# EAGLE design Single_CH_CTRL (EAGLE 9.6.2)

## Sheet 1 of 3
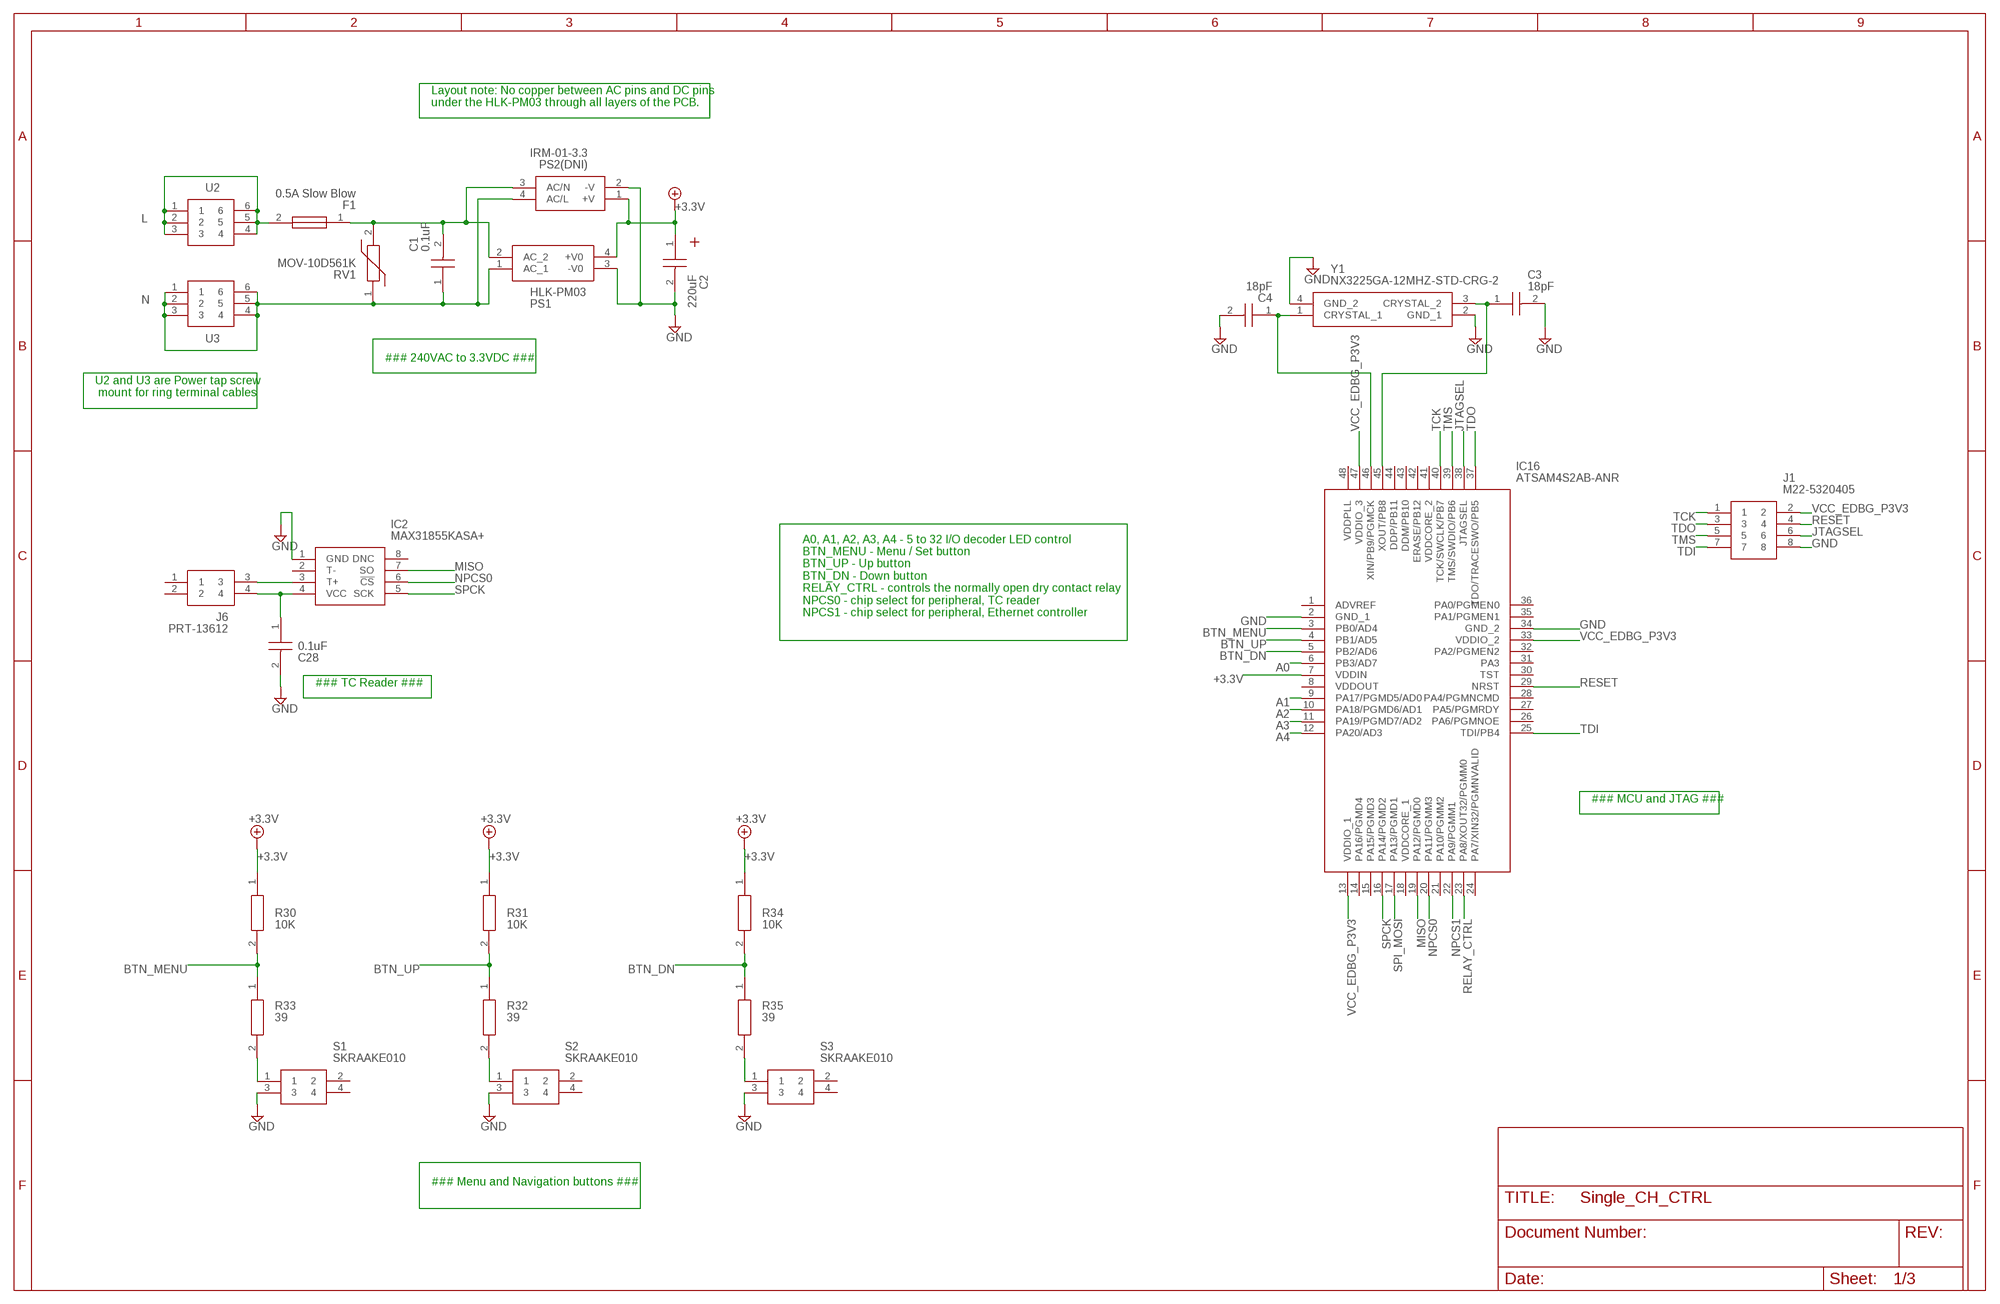
[diagram p0: schematic, sheet 1]

### Parts
C1  0.1uF  B32922X2104K000  [B32922X_(18_X_5)]
C2  220uF  860010473011  [CAPPRD250W52D630H1250]
C3  18pF  04025U180FAT2A  [CAPC1005X56N]
C4  18pF  04025U180FAT2A  [CAPC1005X56N]
C28  0.1uF  C0805C104K5RAC7411  [CAPC2012X88N]
F1  0.5A Slow Blow  RST_500_AMMO  [RST500AMMO]
IC2  MAX31855KASA+  [SOIC127P600X175-8N]
IC16  ATSAM4S2AB-ANR  [QFP50P900X900X160-48N]
J1  M22-5320405  [HUSSP8W50P200_2X4_800X400X500P]
J6  PRT-13612  [PRT13612]
PS1  HLK-PM03  [HLKPM03]
PS2(DNI)  IRM-01-3.3  [IRM015]
R30  10K  CRCW040210K0FKEDC  [RESC1005X35N]
R31  10K  CRCW040210K0FKEDC  [RESC1005X35N]
R32  39  CR0402-FX-39R0GLF  [RESC1005X40N]
R33  39  CR0402-FX-39R0GLF  [RESC1005X40N]
R34  10K  CRCW040210K0FKEDC  [RESC1005X35N]
R35  39  CR0402-FX-39R0GLF  [RESC1005X40N]
RV1  MOV-10D561K  [MOV10D561K]
S1  SKRAAKE010  [SKRAAKE010_1]
S2  SKRAAKE010  [SKRAAKE010_1]
S3  SKRAAKE010  [SKRAAKE010_1]
U2  5055323-9  [50553239]
U3  5055323-9  [50553239]
Y1  NX3225GA-12MHZ-STD-CRG-2  [NX3225GA12MHZSTDCRG2]

### Nets
+3.3V: C2.1(+) IC16.7(VDDIN) PS1.4(+V0) PS2(DNI).1(+V) R30.1 R31.1 R34.1 ; also sheet 2
A0: IC16.6(PB3/AD7)
A1: IC16.9(PA17/PGMD5/AD0)
A2: IC16.10(PA18/PGMD6/AD1)
A3: IC16.11(PA19/PGMD7/AD2)
A4: IC16.12(PA20/AD3)
BTN_DN: IC16.5(PB2/AD6) R34.2 R35.1
BTN_MENU: IC16.3(PB0/AD4) R30.2 R33.1
BTN_UP: IC16.4(PB1/AD5) R31.2 R32.1
GND: C2.2(-) C3.2 C4.2 C28.2 IC2.1(GND) IC16.2(GND_1) IC16.34(GND_2) J1.8 PS1.3(-V0) PS2(DNI).2(-V) S1.3 S2.3 S3.3 Y1.2(GND_1) Y1.4(GND_2) ; also sheet 2,3
JTAGSEL: IC16.38(JTAGSEL) J1.6
L: F1.2 U2.1 U2.2 U2.3 U2.4 U2.5 U2.6
MISO: IC2.7(SO) IC16.19(PA12/PGMD0) ; also sheet 2
N: C1.1 PS1.1(AC_1) PS2(DNI).4(AC/L) RV1.1 U3.1 U3.2 U3.3 U3.4 U3.5 U3.6
N$1: C1.2 F1.1 PS1.2(AC_2) PS2(DNI).3(AC/N) RV1.2
N$2: C3.1 IC16.45(XOUT/PB8) Y1.3(CRYSTAL_2)
N$3: C4.1 IC16.46(XIN/PB9/PGMCK) Y1.1(CRYSTAL_1)
N$80: R33.2 S1.1
N$82: R32.2 S2.1
N$84: R35.2 S3.1
N$221: C28.1 IC2.4(VCC) J6.4
N$225: IC2.3(T+) J6.3
NPCS0: IC2.6(!CS) IC16.20(PA11/PGMM3)
NPCS1: IC16.22(PA9/PGMM1) ; also sheet 2
RELAY_CTRL: IC16.23(PA8/XOUT32/PGMM0) ; also sheet 2
RESET: IC16.29(NRST) J1.4
SPCK: IC2.5(SCK) IC16.16(PA14/PGMD2) ; also sheet 2
SPI_MOSI: IC16.17(PA13/PGMD1) ; also sheet 2
TCK: IC16.40(TCK/SWCLK/PB7) J1.1
TDI: IC16.25(TDI/PB4) J1.7
TDO: IC16.37(TDO/TRACESWO/PB5) J1.3
TMS: IC16.39(TMS/SWDIO/PB6) J1.5
VCC_EDBG_P3V3: IC16.13(VDDIO_1) IC16.33(VDDIO_2) IC16.47(VDDIO_3) J1.2
Unconnected: IC2.2(T-) IC2.8(DNC) IC16.1(ADVREF) IC16.8(VDDOUT) IC16.14(PA16/PGMD4) IC16.15(PA15/PGMD3) IC16.18(VDDCORE_1) IC16.21(PA10/PGMM2) IC16.24(PA7/XIN32/PGMNVALID) IC16.26(PA6/PGMNOE) IC16.27(PA5/PGMRDY) IC16.28(PA4/PGMNCMD) IC16.30(TST) IC16.31(PA3) IC16.32(PA2/PGMEN2) IC16.35(PA1/PGMEN1) IC16.36(PA0/PGMEN0) IC16.41(VDDCORE_2) IC16.42(ERASE/PB12) IC16.43(DDM/PB10) IC16.44(DDP/PB11) IC16.48(VDDPLL) J6.1 J6.2 S1.2 S1.4 S2.2 S2.4 S3.2 S3.4

### Notes on the sheet
- Layout note: No copper between AC pins and DC pins 
  under the HLK-PM03 through all layers of the PCB.
- ### 240VAC to 3.3VDC ###
- U2 and U3 are Power tap screw
   mount for ring terminal cables
- A0, A1, A2, A3, A4 - 5 to 32 I/O decoder LED control
  BTN_MENU - Menu / Set button
  BTN_UP - Up button
  BTN_DN - Down button
  RELAY_CTRL - controls the normally open dry contact relay
  NPCS0 - chip select for peripheral, TC reader
  NPCS1 - chip select for peripheral, Ethernet controller
- ### TC Reader ###
- ### MCU and JTAG ###
- ### Menu and Navigation buttons ###

## Sheet 2 of 3
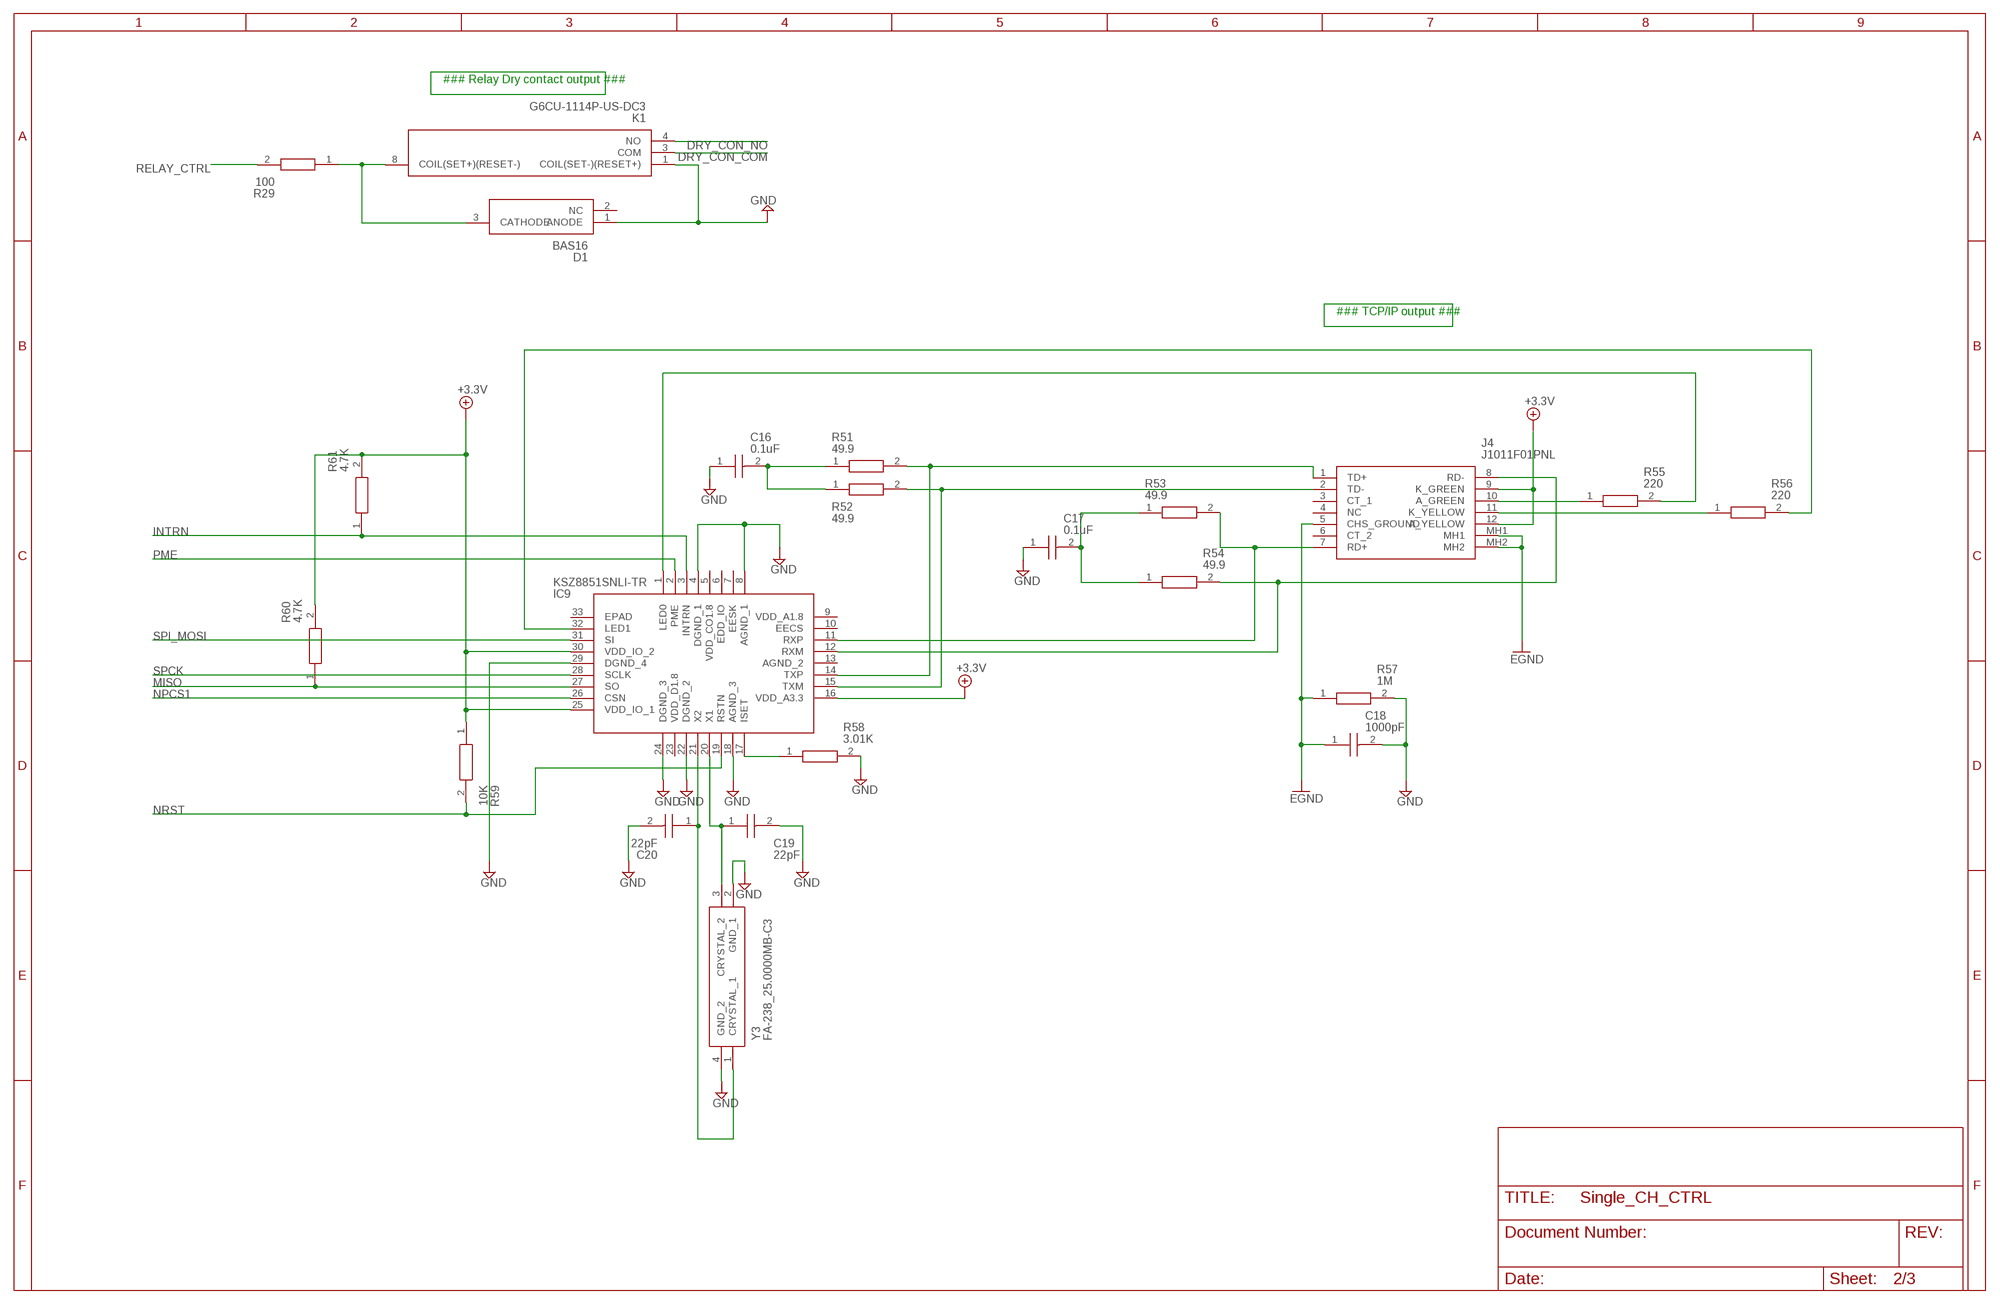
[diagram p1: schematic, sheet 2]

### Parts
C16  0.1uF  C0402C104K4RACTU  [C0402]
C17  0.1uF  C0402C104K4RACTU  [C0402]
C18  1000pF  C4520X7R3D102K130KA  [C4520_COMMERCIAL]
C19  22pF  CBR04C220J5GAC  [CBR04C]
C20  22pF  CBR04C220J5GAC  [CBR04C]
D1  BAS16  [SOT95P240X110-3N]
IC9  KSZ8851SNLI-TR  [QFN50P500X500X100-33N]
J4  J1011F01PNL  [J1011F01PNL]
K1  G6CU-1114P-US-DC3  [G6CU1114PUSDC3]
R29  100  ERJ-PA3F1000V  [ERJP03_PA3_(0603)]
R51  49.9  ERJ-U02F49R9X  [ERJS02_U02_(0402)]
R52  49.9  ERJ-U02F49R9X  [ERJS02_U02_(0402)]
R53  49.9  ERJ-U02F49R9X  [ERJS02_U02_(0402)]
R54  49.9  ERJ-U02F49R9X  [ERJS02_U02_(0402)]
R55  220  CR0402-JW-221GLF  [RESC1005X40N]
R56  220  CR0402-JW-221GLF  [RESC1005X40N]
R57  1M  CHV0805-FX-1004EST  [RESC2012X60N]
R58  3.01K  RC0402FR-073K01L  [RESC1005X40N]
R59  10K  RC0402FR-0710KP  [RESC1005X40N]
R60  4.7K  CR0402-FX-4701GLF  [RESC1005X40N]
R61  4.7K  CR0402-FX-4701GLF  [RESC1005X40N]
Y3  FA-238_25.0000MB-C3  [FA238300000MBC0]

### Nets
+3.3V: IC9.16(VDD_A3.3) IC9.25(VDD_IO_1) IC9.30(VDD_IO_2) J4.9(K_GREEN) J4.12(A_YELLOW) R59.1 R60.2 R61.2 ; also sheet 1
DRY_CON_COM: K1.3(COM)
DRY_CON_NO: K1.4(NO)
GND: C16.1 C17.1 C18.1 C18.2 C19.2 C20.2 D1.1(ANODE) IC9.4(DGND_1) IC9.8(AGND_1) IC9.18(AGND_3) IC9.22(DGND_2) IC9.24(DGND_3) IC9.29(DGND_4) J4.5(CHS_GROUND) J4.MH1 J4.MH2 K1.1(COIL(SET-)(RESET+)) R57.1 R57.2 R58.2 Y3.2(GND_1) Y3.4(GND_2) ; supply symbol labelled EGND ; also sheet 1,3
INTRN: IC9.3(INTRN) R61.1
MISO: IC9.27(SO) R60.1 ; also sheet 1
N$78: D1.3(CATHODE) K1.8(COIL(SET+)(RESET-)) R29.1
N$120: IC9.14(TXP) J4.1(TD+) R51.2
N$121: IC9.15(TXM) J4.2(TD-) R52.2
N$122: IC9.11(RXP) J4.7(RD+) R53.2
N$123: C16.2 R51.1 R52.1
N$124: C17.2 R53.1 R54.1
N$125: IC9.12(RXM) J4.8(RD-) R54.2
N$126: J4.10(A_GREEN) R55.1
N$127: J4.11(K_YELLOW) R56.1
N$128: IC9.1(LED0) R55.2
N$129: IC9.32(LED1) R56.2
N$130: C19.1 IC9.20(X1) Y3.3(CRYSTAL_2)
N$131: C20.1 IC9.21(X2) Y3.1(CRYSTAL_1)
N$132: IC9.17(ISET) R58.1
NPCS1: IC9.26(CSN) ; also sheet 1
NRST: IC9.19(RSTN) R59.2
PME: IC9.2(PME)
RELAY_CTRL: R29.2 ; also sheet 1
SPCK: IC9.28(SCLK) ; also sheet 1
SPI_MOSI: IC9.31(SI) ; also sheet 1
Unconnected: D1.2(NC) IC9.5(VDD_CO1.8) IC9.6(EDD_IO) IC9.7(EESK) IC9.9(VDD_A1.8) IC9.10(EECS) IC9.13(AGND_2) IC9.23(VDD_D1.8) IC9.33(EPAD) J4.3(CT_1) J4.4(NC) J4.6(CT_2)

### Notes on the sheet
- ### Relay Dry contact output ###
- ### TCP/IP output ###

## Sheet 3 of 3
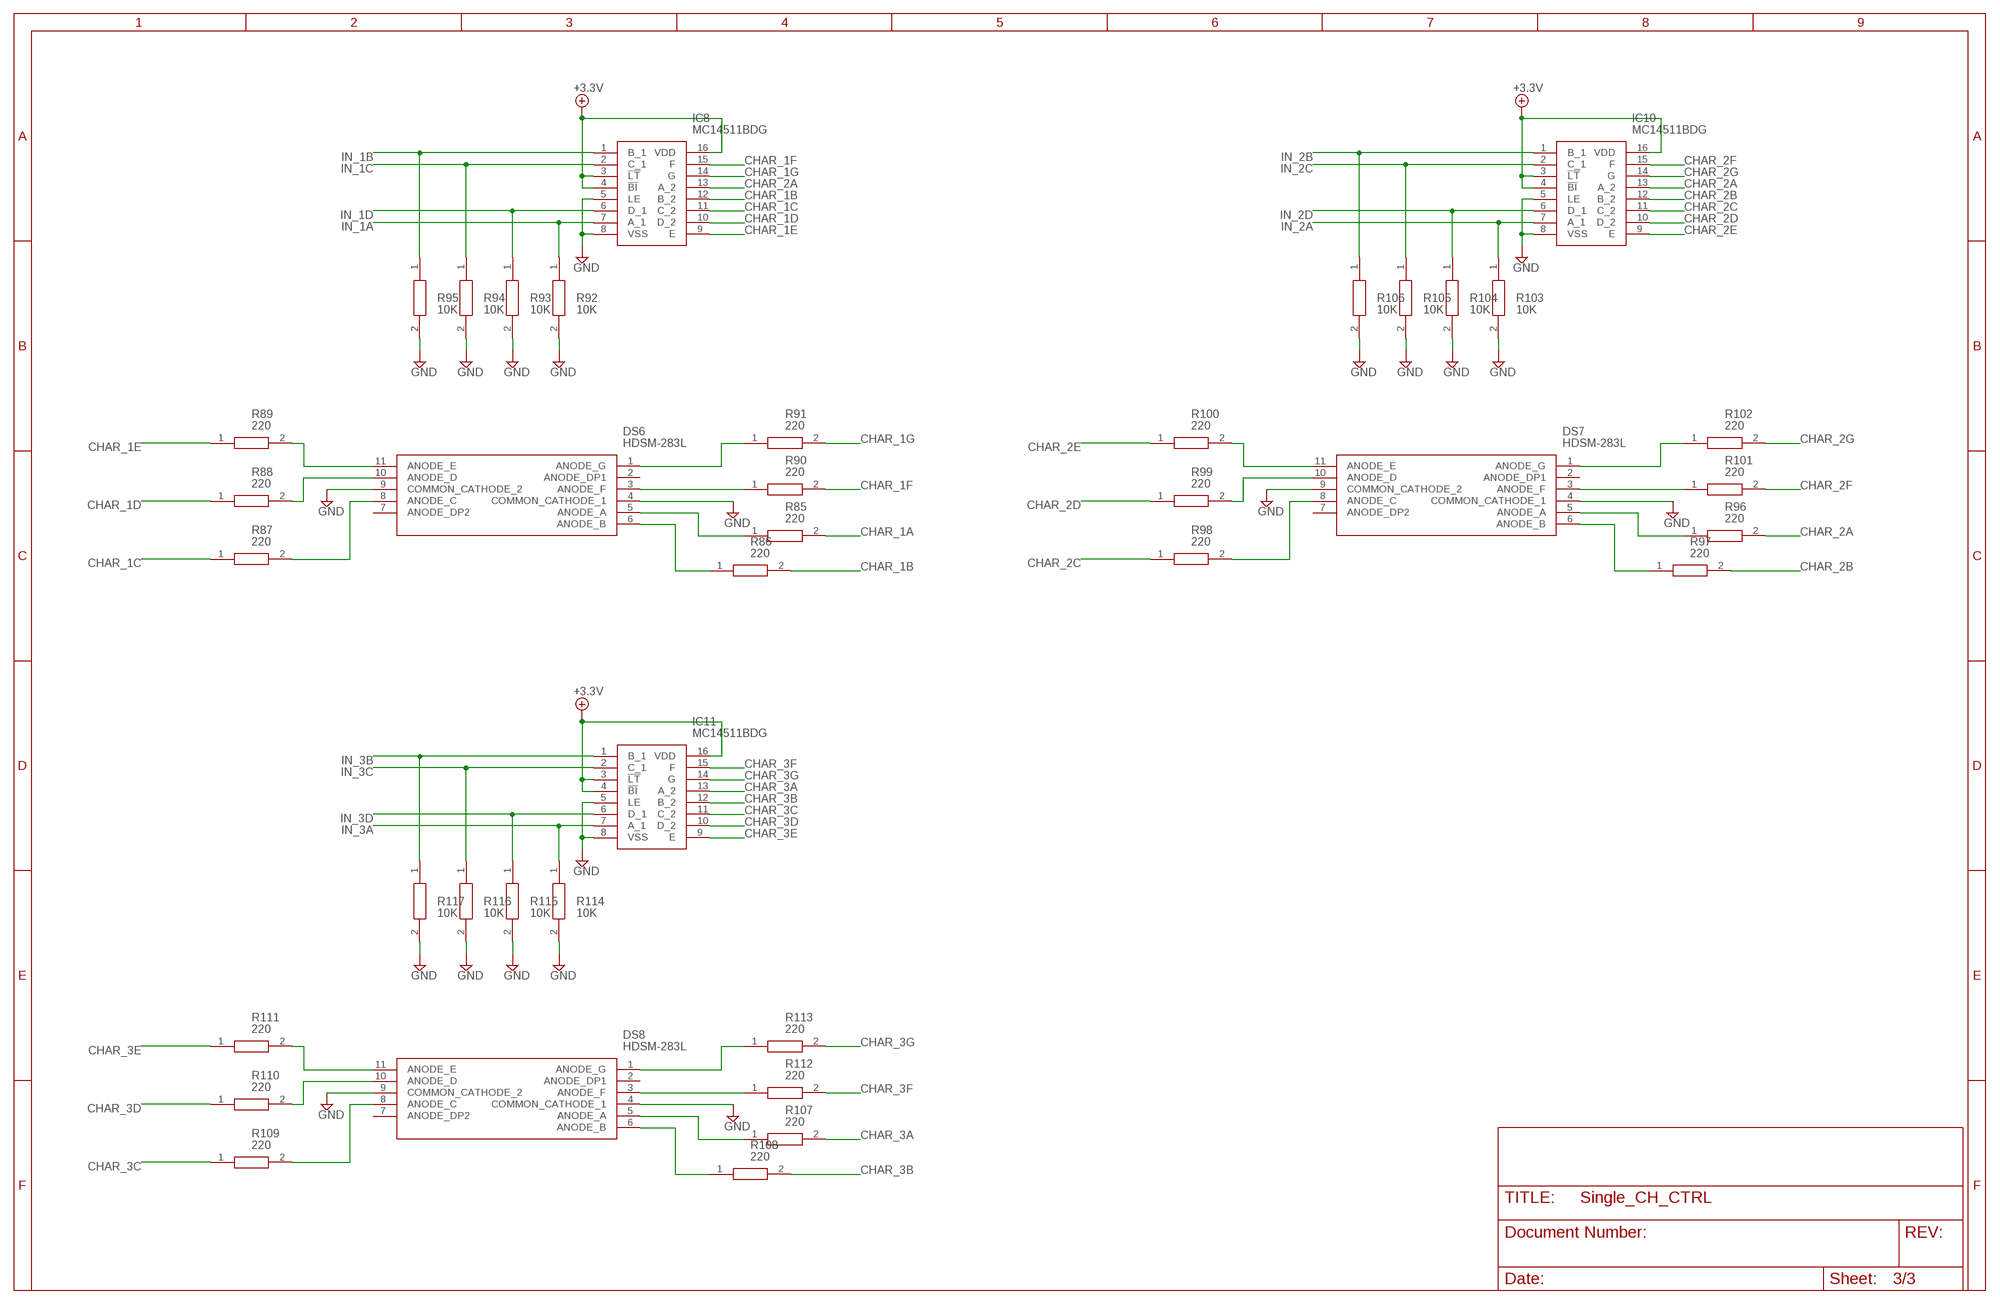
[diagram p2: schematic, sheet 3]

### Parts
DS6  HDSM-283L  [HDSM283L]
DS7  HDSM-283L  [HDSM283L]
DS8  HDSM-283L  [HDSM283L]
IC8  MC14511BDG  [SOIC127P600X175-16N]
IC10  MC14511BDG  [SOIC127P600X175-16N]
IC11  MC14511BDG  [SOIC127P600X175-16N]
R85  220  CR0402-JW-221GLF  [RESC1005X40N]
R86  220  CR0402-JW-221GLF  [RESC1005X40N]
R87  220  CR0402-JW-221GLF  [RESC1005X40N]
R88  220  CR0402-JW-221GLF  [RESC1005X40N]
R89  220  CR0402-JW-221GLF  [RESC1005X40N]
R90  220  CR0402-JW-221GLF  [RESC1005X40N]
R91  220  CR0402-JW-221GLF  [RESC1005X40N]
R92  10K  CRCW040210K0FKEDC  [RESC1005X35N]
R93  10K  CRCW040210K0FKEDC  [RESC1005X35N]
R94  10K  CRCW040210K0FKEDC  [RESC1005X35N]
R95  10K  CRCW040210K0FKEDC  [RESC1005X35N]
R96  220  CR0402-JW-221GLF  [RESC1005X40N]
R97  220  CR0402-JW-221GLF  [RESC1005X40N]
R98  220  CR0402-JW-221GLF  [RESC1005X40N]
R99  220  CR0402-JW-221GLF  [RESC1005X40N]
R100  220  CR0402-JW-221GLF  [RESC1005X40N]
R101  220  CR0402-JW-221GLF  [RESC1005X40N]
R102  220  CR0402-JW-221GLF  [RESC1005X40N]
R103  10K  CRCW040210K0FKEDC  [RESC1005X35N]
R104  10K  CRCW040210K0FKEDC  [RESC1005X35N]
R105  10K  CRCW040210K0FKEDC  [RESC1005X35N]
R106  10K  CRCW040210K0FKEDC  [RESC1005X35N]
R107  220  CR0402-JW-221GLF  [RESC1005X40N]
R108  220  CR0402-JW-221GLF  [RESC1005X40N]
R109  220  CR0402-JW-221GLF  [RESC1005X40N]
R110  220  CR0402-JW-221GLF  [RESC1005X40N]
R111  220  CR0402-JW-221GLF  [RESC1005X40N]
R112  220  CR0402-JW-221GLF  [RESC1005X40N]
R113  220  CR0402-JW-221GLF  [RESC1005X40N]
R114  10K  CRCW040210K0FKEDC  [RESC1005X35N]
R115  10K  CRCW040210K0FKEDC  [RESC1005X35N]
R116  10K  CRCW040210K0FKEDC  [RESC1005X35N]
R117  10K  CRCW040210K0FKEDC  [RESC1005X35N]

### Nets
+5V: IC8.3(!LT) IC8.4(!BI) IC8.16(VDD) IC10.3(!LT) IC10.4(!BI) IC10.16(VDD) IC11.3(!LT) IC11.4(!BI) IC11.16(VDD) ; supply symbol labelled +3.3V
CHAR_1A: R85.2
CHAR_1B: IC8.12(B_2) R86.2
CHAR_1C: IC8.11(C_2) R87.1
CHAR_1D: IC8.10(D_2) R88.1
CHAR_1E: IC8.9(E) R89.1
CHAR_1F: IC8.15(F) R90.2
CHAR_1G: IC8.14(G) R91.2
CHAR_2A: IC8.13(A_2) IC10.13(A_2) R96.2
CHAR_2B: IC10.12(B_2) R97.2
CHAR_2C: IC10.11(C_2) R98.1
CHAR_2D: IC10.10(D_2) R99.1
CHAR_2E: IC10.9(E) R100.1
CHAR_2F: IC10.15(F) R101.2
CHAR_2G: IC10.14(G) R102.2
CHAR_3A: IC11.13(A_2) R107.2
CHAR_3B: IC11.12(B_2) R108.2
CHAR_3C: IC11.11(C_2) R109.1
CHAR_3D: IC11.10(D_2) R110.1
CHAR_3E: IC11.9(E) R111.1
CHAR_3F: IC11.15(F) R112.2
CHAR_3G: IC11.14(G) R113.2
GND: DS6.4(COMMON_CATHODE_1) DS6.9(COMMON_CATHODE_2) DS7.4(COMMON_CATHODE_1) DS7.9(COMMON_CATHODE_2) DS8.4(COMMON_CATHODE_1) DS8.9(COMMON_CATHODE_2) IC8.5(LE) IC8.8(VSS) IC10.5(LE) IC10.8(VSS) IC11.5(LE) IC11.8(VSS) R92.2 R93.2 R94.2 R95.2 R103.2 R104.2 R105.2 R106.2 R114.2 R115.2 R116.2 R117.2 ; also sheet 1,2
IN_1A: IC8.7(A_1) R92.1
IN_1B: IC8.1(B_1) R95.1
IN_1C: IC8.2(C_1) R94.1
IN_1D: IC8.6(D_1) R93.1
IN_2A: IC10.7(A_1) R103.1
IN_2B: IC10.1(B_1) R106.1
IN_2C: IC10.2(C_1) R105.1
IN_2D: IC10.6(D_1) R104.1
IN_3A: IC11.7(A_1) R114.1
IN_3B: IC11.1(B_1) R117.1
IN_3C: IC11.2(C_1) R116.1
IN_3D: IC11.6(D_1) R115.1
N$55: DS6.11(ANODE_E) R89.2
N$56: DS6.8(ANODE_C) R87.2
N$57: DS6.1(ANODE_G) R91.1
N$58: DS6.3(ANODE_F) R90.1
N$59: DS6.5(ANODE_A) R85.1
N$60: DS6.6(ANODE_B) R86.1
N$61: DS6.10(ANODE_D) R88.2
N$62: DS7.11(ANODE_E) R100.2
N$63: DS7.8(ANODE_C) R98.2
N$64: DS7.1(ANODE_G) R102.1
N$65: DS7.3(ANODE_F) R101.1
N$66: DS7.5(ANODE_A) R96.1
N$67: DS7.6(ANODE_B) R97.1
N$68: DS7.10(ANODE_D) R99.2
N$69: DS8.11(ANODE_E) R111.2
N$70: DS8.8(ANODE_C) R109.2
N$71: DS8.1(ANODE_G) R113.1
N$72: DS8.3(ANODE_F) R112.1
N$73: DS8.5(ANODE_A) R107.1
N$74: DS8.6(ANODE_B) R108.1
N$75: DS8.10(ANODE_D) R110.2
Unconnected: DS6.2(ANODE_DP1) DS6.7(ANODE_DP2) DS7.2(ANODE_DP1) DS7.7(ANODE_DP2) DS8.2(ANODE_DP1) DS8.7(ANODE_DP2)

## Library data of the parts
C1 = B32922X2104K000:B32922X2104K000: EMI Suppression Capacitors, 0.1uF, 275Vrms AC, 5m(W) x 10.5m(H) x 18m(L) Source: Datasheet <https://product.tdk.com/system/files/dam/doc/product/capacitor/film/emi/data_sheet/20/20/db/fc_2009/x2_b32921_923_xy.pdf>; ARROW_PART_NUMBER: B32922X2104K000; ARROW_PRICE-STOCK: https://www.arrow.com/en/products/b32922x2104k000/epcos-tdk?region=nac; DESCRIPTION: EMI Suppression Capacitors, 0.1uF, 275Vrms AC, 5m(W) x 10.5m(H) x 18m(L); HEIGHT: 10.5mm; MANUFACTURER_NAME: TDK; MANUFACTURER_PART_NUMBER: B32922X2104K000; MOUSER_PART_NUMBER: 871-B32922X2104K000; MOUSER_PRICE-STOCK: https://www.mouser.co.uk/ProductDetail/EPCOS-TDK/B32922X2104K000?qs=TuK3vfAjtkWDVip5zaCELA%3D%3D
C2 = 860010473011:860010473011: Wurth Elektronik 220uF 25 V dc Aluminium Electrolytic Capacitor, WCAP-ATG8 Series 2000h 6.3 (Dia.) x 11mm Source: Datasheet <https://www.we-online.de/katalog/datasheet/860010473011.pdf>; DESCRIPTION: Wurth Elektronik 220uF 25 V dc Aluminium Electrolytic Capacitor, WCAP-ATG8 Series 2000h 6.3 (Dia.) x 11mm; HEIGHT: 12.5mm; MANUFACTURER_NAME: Wurth Elektronik; MANUFACTURER_PART_NUMBER: 860010473011; MOUSER_PART_NUMBER: 710-860010473011; MOUSER_PRICE-STOCK: https://www.mouser.co.uk/ProductDetail/Wurth-Elektronik/860010473011?qs=0KOYDY2FL2%252Bm07azjhm%2FHQ%3D%3D
C3 C4 = 04025U180FAT2A:04025U180FAT2A: AVX - 04025U180FAT2A - CAP, MLCC, C0G / NP0, 18PF, 50V, 0402 Source: Datasheet <http://www.mouser.com/catalog/supplier/library/pdf/AVXSurfaceMountCeramic.pdf>; ARROW_PART_NUMBER: 04025U180FAT2A; ARROW_PRICE-STOCK: https://www.arrow.com/en/products/04025u180fat2a/avx; DESCRIPTION: AVX - 04025U180FAT2A - CAP, MLCC, C0G / NP0, 18PF, 50V, 0402; HEIGHT: 0.56mm; MANUFACTURER_NAME: AVX; MANUFACTURER_PART_NUMBER: 04025U180FAT2A; MOUSER_PART_NUMBER: 581-04025U180FAT2A; MOUSER_PRICE-STOCK: https://www.mouser.co.uk/ProductDetail/AVX/04025U180FAT2A/?qs=lqAf%2FiVYw9iIZ7dTMzpUiQ%3D%3D
C16 C17 = C0402C104K4RACTU:C0402C104K4RACTU: SMD Comm X7R, Ceramic, 0.1 uF, 10%, 16 VDC, 40 VDC, 125C, -55C, X7R, SMD, MLCC, Temperature Stable, Class II, 10 % , 5 GOhms, 1.21 mg, 0402, 1mm, 0.5mm, 0.5mm, 0.3mm, 0.3mm, 10000, 78 Weeks, 80 Source: Datasheet <https://content.kemet.com/datasheets/KEM_C1002_X7R_SMD.pdf>; ARROW_PART_NUMBER: C0402C104K4RACTU; ARROW_PRICE-STOCK: https://www.arrow.com/en/products/c0402c104k4ractu/kemet-corporation?region=nac; DESCRIPTION: SMD Comm X7R, Ceramic, 0.1 uF, 10%, 16 VDC, 40 VDC, 125C, -55C, X7R, SMD, MLCC, Temperature Stable, Class II, 10 % , 5 GOhms, 1.21 mg, 0402, 1mm, 0.5mm, 0.5mm, 0.3mm, 0.3mm, 10000, 78 Weeks, 80; HEIGHT: 0.55mm; MANUFACTURER_NAME: KEMET; MANUFACTURER_PART_NUMBER: C0402C104K4RACTU; MOUSER_PART_NUMBER: 80-C0402C104K4R; MOUSER_PRICE-STOCK: https://www.mouser.co.uk/ProductDetail/KEMET/C0402C104K4RACTU?qs=DBJr%252BvBUjU54jK7d4uAeew%3D%3D
C18 = C4520X7R3D102K130KA:C4520X7R3D102K130KA: MULTILAYER CERAMIC CHIP CAPACITORS, 4520, Commercial grade, general (Up to 75V) Source: Datasheet <https://product.tdk.com/system/files/dam/doc/product/capacitor/ceramic/mlcc/catalog/mlcc_commercial_highvoltage_en.pdf>; ARROW_PART_NUMBER: C4520X7R3D102K130KA; ARROW_PRICE-STOCK: https://www.arrow.com/en/products/c4520x7r3d102k130ka/tdk; DESCRIPTION: MULTILAYER CERAMIC CHIP CAPACITORS, 4520, Commercial grade, general (Up to 75V); HEIGHT: 1mm; MANUFACTURER_NAME: TDK; MANUFACTURER_PART_NUMBER: C4520X7R3D102K130KA; MOUSER_PART_NUMBER: 810-C4520X7R3D102K; MOUSER_PRICE-STOCK: https://www.mouser.co.uk/ProductDetail/TDK/C4520X7R3D102K130KA?qs=NRhsANhppD%2FmDDEB06mgKg%3D%3D
C19 C20 = CBR04C220J5GAC:CBR04C220J5GAC: CBR-SMD RF C0G, Ceramic, 22 pF, 5%, 50 VDC, 125 VDC, 125C, -55C, C0G, SMD, Fixed, RF, Ultra High Q, Low ESR, Class I, 0.12 % , 10 GOhms, 840, 1.4 mg, 0402, 1mm, 0.5mm, 0.5mm, 0.25mm, 10000, 78 Weeks, 120 Source: Datasheet <https://content.kemet.com/datasheets/KEM_C1030_CBR_SMD.pdf>; ARROW_PART_NUMBER: CBR04C220J5GAC; ARROW_PRICE-STOCK: https://www.arrow.com/en/products/cbr04c220j5gac/kemet-corporation?region=nac; DESCRIPTION: CBR-SMD RF C0G, Ceramic, 22 pF, 5%, 50 VDC, 125 VDC, 125C, -55C, C0G, SMD, Fixed, RF, Ultra High Q, Low ESR, Class I, 0.12 % , 10 GOhms, 840, 1.4 mg, 0402, 1mm, 0.5mm, 0.5mm, 0.25mm, 10000, 78 Weeks, 120; HEIGHT: mm; MANUFACTURER_NAME: KEMET; MANUFACTURER_PART_NUMBER: CBR04C220J5GAC; MOUSER_PART_NUMBER: 80-CBR04C220J5G; MOUSER_PRICE-STOCK: https://www.mouser.co.uk/ProductDetail/KEMET/CBR04C220J5GAC?qs=BjUX18ghZXi0endstTtQyQ%3D%3D
C28 = C0805C104K5RAC7411:C0805C104K5RAC7411: Cap Ceramic 0.1uF 50V X7R 10% Pad SMD 0805 125C T/R Source: Datasheet <https://www.mouser.com/datasheet/2/212/KEM_C1002_X7R_SMD-1102033.pdf>; ARROW_PART_NUMBER: C0805C104K5RAC7411; ARROW_PRICE-STOCK: https://www.arrow.com/en/products/c0805c104k5rac7411/kemet-corporation; DESCRIPTION: Cap Ceramic 0.1uF 50V X7R 10% Pad SMD 0805 125C T/R; HEIGHT: 0.88mm; MANUFACTURER_NAME: KEMET; MANUFACTURER_PART_NUMBER: C0805C104K5RAC7411; MOUSER_PART_NUMBER: 80-C0805C104K5RACLR; MOUSER_PRICE-STOCK: https://www.mouser.co.uk/ProductDetail/KEMET/C0805C104K5RAC7411?qs=jbRM9o5BbzPcVXF0wW9AYg%3D%3D
D1 = BAS16:BAS16: Small signal diode,BAS16 0.25A 85V Infineon BAS16, SMT Switching Diode, 85V 250mA, 4ns, 3-Pin SOT-23 Source: Datasheet <https://www.infineon.com/dgdl/Infineon-BAS16SERIES-DS-v01_01-en.pdf?fileId=db3a30431400ef6801141b93811b03ff>; DESCRIPTION: Small signal diode,BAS16 0.25A 85V Infineon BAS16, SMT Switching Diode, 85V 250mA, 4ns, 3-Pin SOT-23; HEIGHT: 1.1mm; MANUFACTURER_NAME: Infineon; MANUFACTURER_PART_NUMBER: BAS16
DS6-DS8 = HDSM-283L:HDSM-283L: LED Displays & Accessories Org 605nm 8.5mcd CC SD 7 Segment Source: Datasheet <https://datasheet.datasheetarchive.com/originals/distributors/SFDatasheet-4/sf-00083599.pdf>; DESCRIPTION: LED Displays & Accessories Org 605nm 8.5mcd CC SD 7 Segment; HEIGHT: 3.15mm; MANUFACTURER_NAME: Avago Technologies; MANUFACTURER_PART_NUMBER: HDSM-283L; MOUSER_PART_NUMBER: 630-HDSM-283L; MOUSER_PRICE-STOCK: https://www.mouser.co.uk/ProductDetail/Broadcom-Avago/HDSM-283L?qs=NCV3C3qdz%2FC%2FCUC6%2FdWPrA%3D%3D
F1 = RST_500_AMMO:RST_500_AMMO: Fuse Micro Slow Blow Acting 0.5A 250V Radial 8.35 X 4 X 8.2mm Ammo CCC/PSE/SEMKO/VDE/cULus Source: Datasheet <https://belfuse.com/resources/datasheets/circuitprotection/ds-cp-rst-series.pdf>; ARROW_PART_NUMBER: RST 500 AMMO; ARROW_PRICE-STOCK: https://www.arrow.com/en/products/rst500-ammo/bel-group; DESCRIPTION: Fuse Micro Slow Blow Acting 0.5A 250V Radial 8.35 X 4 X 8.2mm Ammo CCC/PSE/SEMKO/VDE/cULus; HEIGHT: 7.9mm; MANUFACTURER_NAME: Stewart Connector; MANUFACTURER_PART_NUMBER: RST 500 AMMO; MOUSER_PART_NUMBER: 530-RST500AMMO; MOUSER_PRICE-STOCK: https://www.mouser.co.uk/ProductDetail/Bel-Fuse/RST-500-AMMO?qs=MvPYbBWWJyujgJzBtIxlxw%3D%3D
IC2 = MAX31855KASA+:MAX31855KASA+: MAX31855KASA+, 14 bit Temperature Sensor +/-2 C SPI 3 3.6 V 8-Pin SOIC Source: Datasheet <https://datasheets.maximintegrated.com/en/ds/MAX31855.pdf>; ARROW_PART_NUMBER: MAX31855KASA+; ARROW_PRICE-STOCK: https://www.arrow.com/en/products/max31855kasa/maxim-integrated?region=nac; DESCRIPTION: MAX31855KASA+, 14 bit Temperature Sensor +/-2 C SPI 3 3.6 V 8-Pin SOIC; HEIGHT: 1.75mm; MANUFACTURER_NAME: Maxim Integrated; MANUFACTURER_PART_NUMBER: MAX31855KASA+; MOUSER_PART_NUMBER: 700-MAX31855KASA+; MOUSER_PRICE-STOCK: https://www.mouser.co.uk/ProductDetail/Maxim-Integrated/MAX31855KASA%2b?qs=ffX8NcjNb2QF5YDuL5Qj5g%3D%3D
IC8 IC10 IC11 = MC14511BDG:MC14511BDG: Encoders, Decoders, Multiplexers & Demultiplexers 3-18V BCD/7-Segment Decoder Source: Datasheet <http://www.onsemi.com/pub/Collateral/MC14511B-D.PDF>; ARROW_PART_NUMBER: MC14511BDG; ARROW_PRICE-STOCK: https://www.arrow.com/en/products/mc14511bdg/on-semiconductor?region=nac; DESCRIPTION: Encoders, Decoders, Multiplexers & Demultiplexers 3-18V BCD/7-Segment Decoder; HEIGHT: 1.75mm; MANUFACTURER_NAME: onsemi; MANUFACTURER_PART_NUMBER: MC14511BDG; MOUSER_PART_NUMBER: 863-MC14511BDG; MOUSER_PRICE-STOCK: https://www.mouser.co.uk/ProductDetail/onsemi/MC14511BDG?qs=g2rIOKKlpoZ%252B2JvtniauVg%3D%3D
IC9 = KSZ8851SNLI-TR:KSZ8851SNLI-TR: Microchip KSZ8851SNLI-TR, Ethernet Controller, 100Mbps MDI/MDIX, MII, SPI, 1.8 V, 2.5 V, 3.3 V, 32-Pin MLF Source: Datasheet <http://www.microchip.com/mymicrochip/filehandler.aspx?ddocname=en581700>; ARROW_PART_NUMBER: KSZ8851SNLI-TR; ARROW_PRICE-STOCK: https://www.arrow.com/en/products/ksz8851snli-tr/microchip-technology; DESCRIPTION: Microchip KSZ8851SNLI-TR, Ethernet Controller, 100Mbps MDI/MDIX, MII, SPI, 1.8 V, 2.5 V, 3.3 V, 32-Pin MLF; HEIGHT: 1mm; MANUFACTURER_NAME: Microchip; MANUFACTURER_PART_NUMBER: KSZ8851SNLI-TR; MOUSER_PART_NUMBER: 998-KSZ8851SNLITR; MOUSER_PRICE-STOCK: https://www.mouser.co.uk/ProductDetail/Microchip-Technology-Atmel/KSZ8851SNLI-TR?qs=U6T8BxXiZAVOThG4jr6SOQ%3D%3D
IC16 = ATSAM4S2AB-ANR:ATSAM4S2AB-ANR: ARM Microcontrollers - MCU 48LQFP,GREEN,EXT TEMP(105C),MRL B,128K FLASH,64K SRAM Source: Datasheet <http://ww1.microchip.com/downloads/en/DeviceDoc/Atmel-11100-32-bit Cortex-M4-Microcontroller-SAM4S_Datasheet.pdf>; ARROW_PART_NUMBER: ATSAM4S2AB-ANR; ARROW_PRICE-STOCK: https://www.arrow.com/en/products/atsam4s2ab-anr/microchip-technology; DESCRIPTION: ARM Microcontrollers - MCU 48LQFP,GREEN,EXT TEMP(105C),MRL B,128K FLASH,64K SRAM; HEIGHT: 1.6mm; MANUFACTURER_NAME: Microchip; MANUFACTURER_PART_NUMBER: ATSAM4S2AB-ANR; MOUSER_PART_NUMBER: 556-ATSAM4S2AB-ANR; MOUSER_PRICE-STOCK: https://www.mouser.co.uk/ProductDetail/Microchip-Technology-Atmel/ATSAM4S2AB-ANR?qs=YCa%2FAAYMW03qmCNY%252BxWbcQ%3D%3D
J1 = M22-5320405:M22-5320405: 2.00mm (0.079") Pitch DIL Vertical SMT Pin Header, gold, 4+4 contacts Source: Datasheet <https://cdn.harwin.com/pdfs/M22-532.pdf>; DESCRIPTION: 2.00mm (0.079") Pitch DIL Vertical SMT Pin Header, gold, 4+4 contacts; HEIGHT: mm; MANUFACTURER_NAME: Harwin; MANUFACTURER_PART_NUMBER: M22-5320405; MOUSER_PART_NUMBER: 855-M22-5320405; MOUSER_PRICE-STOCK: https://www.mouser.co.uk/ProductDetail/Harwin/M22-5320405?qs=WS5Jv%252B%252Bx1qVxYYIoWES7kw%3D%3D
J4 = J1011F01PNL:J1011F01PNL: Modular Connectors / Ethernet Connectors 1CT:1CT GRN/YEL Source: Datasheet <https://productfinder.pulseeng.com/doc_type/WEB301/doc_num/J402/doc_part/J402.pdf>; ARROW_PART_NUMBER: J1011F01PNL; ARROW_PRICE-STOCK: https://www.arrow.com/en/products/j1011f01pnl/pulse-electronics-corporation?region=nac; DESCRIPTION: Modular Connectors / Ethernet Connectors 1CT:1CT GRN/YEL; HEIGHT: 14.22mm; MANUFACTURER_NAME: Pulse; MANUFACTURER_PART_NUMBER: J1011F01PNL; MOUSER_PART_NUMBER: 673-J1011F01PNL; MOUSER_PRICE-STOCK: https://www.mouser.co.uk/ProductDetail/Pulse-Electronics/J1011F01PNL?qs=8Pd6UH4uLB8hnov%252Bey5RRg%3D%3D
J6 = PRT-13612:PRT-13612: THERMOCOUPLE CONN - PCC-SMP-K Source: Datasheet <https://cdn.sparkfun.com/datasheets/Prototyping/PCC-SMP-K-datasheet.pdf>; ARROW_PART_NUMBER: PRT-13612; ARROW_PRICE-STOCK: https://www.arrow.com/en/products/prt-13612/sparkfun-electronics; DESCRIPTION: THERMOCOUPLE CONN - PCC-SMP-K; HEIGHT: 6.3mm; MANUFACTURER_NAME: SparkFun; MANUFACTURER_PART_NUMBER: PRT-13612; MOUSER_PART_NUMBER: 474-PRT-13612; MOUSER_PRICE-STOCK: https://www.mouser.co.uk/ProductDetail/SparkFun/PRT-13612?qs=WyAARYrbSnbvS1kDzRVYBg%3D%3D
K1 = G6CU-1114P-US-DC3:G6CU-1114P-US-DC3: Electromechanical Relay SPST-NO 10A 3VDC 45Ohm Through Hole - Bulk Source: Datasheet <https://www.mouser.mx/ProductDetail/Omron-Electronics/G6CU-1114P-US-DC3?qs=wkx8pu8tL7J61R5utGxXEw==>; DESCRIPTION: Electromechanical Relay SPST-NO 10A 3VDC 45Ohm Through Hole - Bulk; HEIGHT: 10mm; MANUFACTURER_NAME: Omron Electronics; MANUFACTURER_PART_NUMBER: G6CU-1114P-US-DC3; MOUSER_PART_NUMBER: 653-G6CU-1114P-USDC3; MOUSER_PRICE-STOCK: https://www.mouser.co.uk/ProductDetail/Omron-Electronics/G6CU-1114P-US-DC3?qs=wkx8pu8tL7J61R5utGxXEw%3D%3D
PS1 = HLK-PM03:HLK-PM03: Power Module AC-DC Through Hole RoHS Source: Datasheet <https://datasheet.lcsc.com/szlcsc/1906201102_HI-LINK-HLK-PM03_C209904.pdf>; DESCRIPTION: Power Module AC-DC Through Hole RoHS; HEIGHT: 15mm; MANUFACTURER_NAME: Hi-Link; MANUFACTURER_PART_NUMBER: HLK-PM03
PS2(DNI) = IRM-01-3.3:IRM-01-3.3: Power Supply Encapsulated PCB 3.3V 1W Source: Datasheet <https://www.meanwell.com/Upload/PDF/IRM-01/IRM-01-SPEC.PDF>; ARROW_PART_NUMBER: IRM-01-3.3; ARROW_PRICE-STOCK: https://www.arrow.com/en/products/irm-01-3.3/mean-well-enterprises?region=nac; DESCRIPTION: Power Supply Encapsulated PCB 3.3V 1W; HEIGHT: 15mm; MANUFACTURER_NAME: Mean Well; MANUFACTURER_PART_NUMBER: IRM-01-3.3; MOUSER_PART_NUMBER: 709-IRM01-3.3; MOUSER_PRICE-STOCK: https://www.mouser.co.uk/ProductDetail/MEAN-WELL/IRM-01-3.3?qs=C9r8PV%2F%252BoWPYMhpLuTFr9w%3D%3D
R29 = ERJ-PA3F1000V:ERJ-PA3F1000V: ERJPA3 Resistors 0.25W 0603 100R 1% Panasonic ERJPA3 Series Thick Film Surface Mount Resistor 0603 Case 100 +/-1% 0.25W +/-100ppm/C Source: Datasheet <https://industrial.panasonic.com/cdbs/www-data/pdf/RDO0000/AOA0000C331.pdf>; DESCRIPTION: ERJPA3 Resistors 0.25W 0603 100R 1% Panasonic ERJPA3 Series Thick Film Surface Mount Resistor 0603 Case 100 +/-1% 0.25W +/-100ppm/C; HEIGHT: 0.55mm; MANUFACTURER_NAME: Panasonic; MANUFACTURER_PART_NUMBER: ERJ-PA3F1000V; MOUSER_PART_NUMBER: 667-ERJ-PA3F1000V; MOUSER_PRICE-STOCK: https://www.mouser.com/Search/Refine.aspx?Keyword=667-ERJ-PA3F1000V
R30 R31 R34 R92-R95 R103-R106 R114-R117 = CRCW040210K0FKEDC:CRCW040210K0FKEDC: VISHAY - CRCW040210K0FKEDC - RES, THICK FILM, 10K, 0.063W, 0402 Source: Datasheet <https://rs.componentsearchengine.com/Datasheets/2/CRCW040210K0FKEDC.pdf>; ARROW_PART_NUMBER: CRCW040210K0FKEDC; ARROW_PRICE-STOCK: https://www.arrow.com/en/products/crcw040210k0fkedc/vishay?region=nac; DESCRIPTION: VISHAY - CRCW040210K0FKEDC - RES, THICK FILM, 10K, 0.063W, 0402; HEIGHT: 0.35mm; MANUFACTURER_NAME: Vishay; MANUFACTURER_PART_NUMBER: CRCW040210K0FKEDC; MOUSER_PART_NUMBER: 71-CRCW040210K0FKEDC; MOUSER_PRICE-STOCK: https://www.mouser.co.uk/ProductDetail/Vishay-Dale/CRCW040210K0FKEDC?qs=E3Y5ESvWgWPiNLcGzwCGPg%3D%3D
R32 R33 R35 = CR0402-FX-39R0GLF:CR0402-FX-39R0GLF: Thick Film Resistors - SMD 39 OHM 1% Source: Datasheet <https://www.bourns.com/pdfs/CR0402.pdf>; DESCRIPTION: Thick Film Resistors - SMD 39 OHM 1%; HEIGHT: 0.4mm; MANUFACTURER_NAME: Bourns; MANUFACTURER_PART_NUMBER: CR0402-FX-39R0GLF; MOUSER_PART_NUMBER: 652-CR0402FX-39R0GLF; MOUSER_PRICE-STOCK: https://www.mouser.com/Search/Refine.aspx?Keyword=652-CR0402FX-39R0GLF
R51-R54 = ERJ-U02F49R9X:ERJ-U02F49R9X: Anti-Sulfurated Thick Film Chip Resistor, 0402, 0.1W Source: Datasheet <https://industrial.panasonic.com/cdbs/www-data/pdf/RDP0000/AOA0000C334.pdf>; DESCRIPTION: Anti-Sulfurated Thick Film Chip Resistor, 0402, 0.1W; HEIGHT: 0.4mm; MANUFACTURER_NAME: Panasonic; MANUFACTURER_PART_NUMBER: ERJ-U02F49R9X
R55 R56 R85-R91 R96-R102 R107-R113 = CR0402-JW-221GLF:CR0402-JW-221GLF: Thick Film Resistors - SMD 220 OHM 5% Source: Datasheet <https://www.bourns.com/pdfs/CR0402.pdf>; ARROW_PART_NUMBER: CR0402-JW-221GLF; ARROW_PRICE-STOCK: https://www.arrow.com/en/products/cr0402-jw-221glf/bourns; DESCRIPTION: Thick Film Resistors - SMD 220 OHM 5%; HEIGHT: 0.4mm; MANUFACTURER_NAME: Bourns; MANUFACTURER_PART_NUMBER: CR0402-JW-221GLF; MOUSER_PART_NUMBER: 652-CR0402JW-221GLF; MOUSER_PRICE-STOCK: https://www.mouser.com/Search/Refine.aspx?Keyword=652-CR0402JW-221GLF
R57 = CHV0805-FX-1004EST:CHV0805-FX-1004EST: ResHV ST 0805 1M 1% 0.125W TCR100 Source: Datasheet <https://www.digikey.com/en/products/detail/bourns-inc/CHV0805-JW-334ELF/5175970>; DESCRIPTION: ResHV ST 0805 1M 1% 0.125W TCR100; HEIGHT: 0.6mm; MANUFACTURER_NAME: Bourns; MANUFACTURER_PART_NUMBER: CHV0805-FX-1004EST; MOUSER_PART_NUMBER: 652-CHV0805FX1004EST; MOUSER_PRICE-STOCK: https://www.mouser.co.uk/ProductDetail/Bourns/CHV0805-FX-1004EST?qs=QNEnbhJQKvb69hgGpv9kmQ%3D%3D
R58 = RC0402FR-073K01L:RC0402FR-073K01L: Thick Film Resistors - SMD 3.01K OHM 1% Source: Datasheet <https://datasheet.datasheetarchive.com/originals/distributors/Datasheets_SAMA/902f9e387b938f871d31120f5fc1d65e.pdf>; ARROW_PART_NUMBER: RC0402FR-073K01L; ARROW_PRICE-STOCK: https://www.arrow.com/en/products/rc0402fr-073k01l/yageo; DESCRIPTION: Thick Film Resistors - SMD 3.01K OHM 1%; HEIGHT: 0.4mm; MANUFACTURER_NAME: KEMET; MANUFACTURER_PART_NUMBER: RC0402FR-073K01L; MOUSER_PART_NUMBER: 603-RC0402FR-073K01L; MOUSER_PRICE-STOCK: https://www.mouser.com/Search/Refine.aspx?Keyword=603-RC0402FR-073K01L
R59 = RC0402FR-0710KP:RC0402FR-0710KP: YAGEO - RC0402FR-0710KP - SMD Chip Resistor, 10 kohm, +/- 1%, 62.5 mW, 0402 [1005 Metric], Thick Film, General Purpose Source: Datasheet <https://componentsearchengine.com/Datasheets/2/RC0402FR-0710KP.pdf>; ARROW_PART_NUMBER: RC0402FR-0710KP; ARROW_PRICE-STOCK: https://www.arrow.com/en/products/rc0402fr-0710kp/yageo?region=nac; DESCRIPTION: YAGEO - RC0402FR-0710KP - SMD Chip Resistor, 10 kohm, +/- 1%, 62.5 mW, 0402 [1005 Metric], Thick Film, General Purpose; HEIGHT: 0.4mm; MANUFACTURER_NAME: KEMET; MANUFACTURER_PART_NUMBER: RC0402FR-0710KP; MOUSER_PART_NUMBER: 603-RC0402FR-0710KP; MOUSER_PRICE-STOCK: https://www.mouser.co.uk/ProductDetail/YAGEO/RC0402FR-0710KP?qs=oypCK0zG325Ov8hhvMZZMg%3D%3D
R60 R61 = CR0402-FX-4701GLF:CR0402-FX-4701GLF: Thick Film Resistors - SMD 4.7K OHM 1% Source: Datasheet <https://www.bourns.com/pdfs/CR0402.pdf>; DESCRIPTION: Thick Film Resistors - SMD 4.7K OHM 1%; HEIGHT: 0.4mm; MANUFACTURER_NAME: Bourns; MANUFACTURER_PART_NUMBER: CR0402-FX-4701GLF; MOUSER_PART_NUMBER: 652-CR0402FX-4701GLF; MOUSER_PRICE-STOCK: https://www.mouser.co.uk/ProductDetail/Bourns/CR0402-FX-4701GLF?qs=ePR1ZvdkOKK%252Bab9lx6TEtw%3D%3D
RV1 = MOV-10D561K:MOV-10D561K: Varistors 180pF 560volts 10% Source: Datasheet <https://www.bourns.com/docs/Product-Datasheets/MOV10D.pdf>; ARROW_PART_NUMBER: MOV-10D561K; ARROW_PRICE-STOCK: https://www.arrow.com/en/products/mov-10d561k/bourns; DESCRIPTION: Varistors 180pF 560volts 10%; HEIGHT: 15.5mm; MANUFACTURER_NAME: Bourns; MANUFACTURER_PART_NUMBER: MOV-10D561K; MOUSER_PART_NUMBER: 652-MOV-10D561K; MOUSER_PRICE-STOCK: https://www.mouser.co.uk/ProductDetail/Bourns/MOV-10D561K?qs=lgttKnAd%252B2ArrqGQgWwr6w%3D%3D
S1-S3 = SKRAAKE010:SKRAAKE010: Tact switch,SMT,SPST,white,2.45N o/force White Stem Tactile Switch, SPST-NO 50 mA 3.4mm Source: Datasheet; ARROW_PART_NUMBER: SKRAAKE010; ARROW_PRICE-STOCK: https://www.arrow.com/en/products/skraake010/alps-electric; DESCRIPTION: Tact switch,SMT,SPST,white,2.45N o/force White Stem Tactile Switch, SPST-NO 50 mA 3.4mm; HEIGHT: mm; MANUFACTURER_NAME: ALPS Electric; MANUFACTURER_PART_NUMBER: SKRAAKE010; MOUSER_PART_NUMBER: 688-SKRAAK; MOUSER_PRICE-STOCK: https://www.mouser.co.uk/ProductDetail/Alps-Alpine/SKRAAKE010?qs=W5eanQMd1BB0RPz8ZhKlUA%3D%3D
U2 U3 = 5055323-9:5055323-9: AMP - TE CONNECTIVITY - 5055323-9 - POWER TAB, ASSEMBLY, WITH SCREW Source: Datasheet <https://componentsearchengine.com/Datasheets/1/5055323-9.pdf>; ARROW_PART_NUMBER: 5055323-9; ARROW_PRICE-STOCK: https://www.arrow.com/en/products/5055323-9/te-connectivity; DESCRIPTION: AMP - TE CONNECTIVITY - 5055323-9 - POWER TAB, ASSEMBLY, WITH SCREW; HEIGHT: 7.2898mm; MANUFACTURER_NAME: TE Connectivity; MANUFACTURER_PART_NUMBER: 5055323-9; MOUSER_PART_NUMBER: 571-5055323-9; MOUSER_PRICE-STOCK: https://www.mouser.co.uk/ProductDetail/TE-Connectivity/5055323-9?qs=Ko7makLHeK5WcBiq4KwKgA%3D%3D
Y1 = NX3225GA-12MHZ-STD-CRG-2:NX3225GA-12MHZ-STD-CRG-2: NDK 12MHz Crystal Unit +/-20ppm SMD 4-Pin 3.2 x 2.5 x 0.75mm Source: Datasheet <https://datasheet.datasheetarchive.com/originals/distributors/Datasheets_SAMA/e448b11b6d77781431a8823f463adabd.pdf>; DESCRIPTION: NDK 12MHz Crystal Unit +/-20ppm SMD 4-Pin 3.2 x 2.5 x 0.75mm; HEIGHT: 0.9mm; MANUFACTURER_NAME: NDK; MANUFACTURER_PART_NUMBER: NX3225GA-12MHZ-STD-CRG-2; MOUSER_PART_NUMBER: 344-NX3225GA12STCRG2; MOUSER_PRICE-STOCK: https://www.mouser.co.uk/ProductDetail/NDK/NX3225GA-12MHZ-STD-CRG-2?qs=w%2Fv1CP2dgqoRB9b4zEbU%252BQ%3D%3D
Y3 = FA-238_25.0000MB-C3:FA-238_25.0000MB-C3: Crystals 25MHz 50ppm 18pF -20C +70C Source: Datasheet <https://support.epson.biz/td/api/doc_check.php?dl=brief_FA-238&lang=en>; ARROW_PART_NUMBER: FA-238 25.0000MB-C3; ARROW_PRICE-STOCK: https://www.arrow.com/en/products/fa-23825.0000mb-c3/epson-electronics-america; DESCRIPTION: Crystals 25MHz 50ppm 18pF -20C +70C; HEIGHT: 0.7mm; MANUFACTURER_NAME: Epson Timing; MANUFACTURER_PART_NUMBER: FA-238 25.0000MB-C3; MOUSER_PART_NUMBER: 732-FA238-25B-C3; MOUSER_PRICE-STOCK: https://www.mouser.co.uk/ProductDetail/Epson-Timing/FA-238-25.0000MB-C3?qs=CANAagUtPAqYIDF5A41Crg%3D%3D

## Board
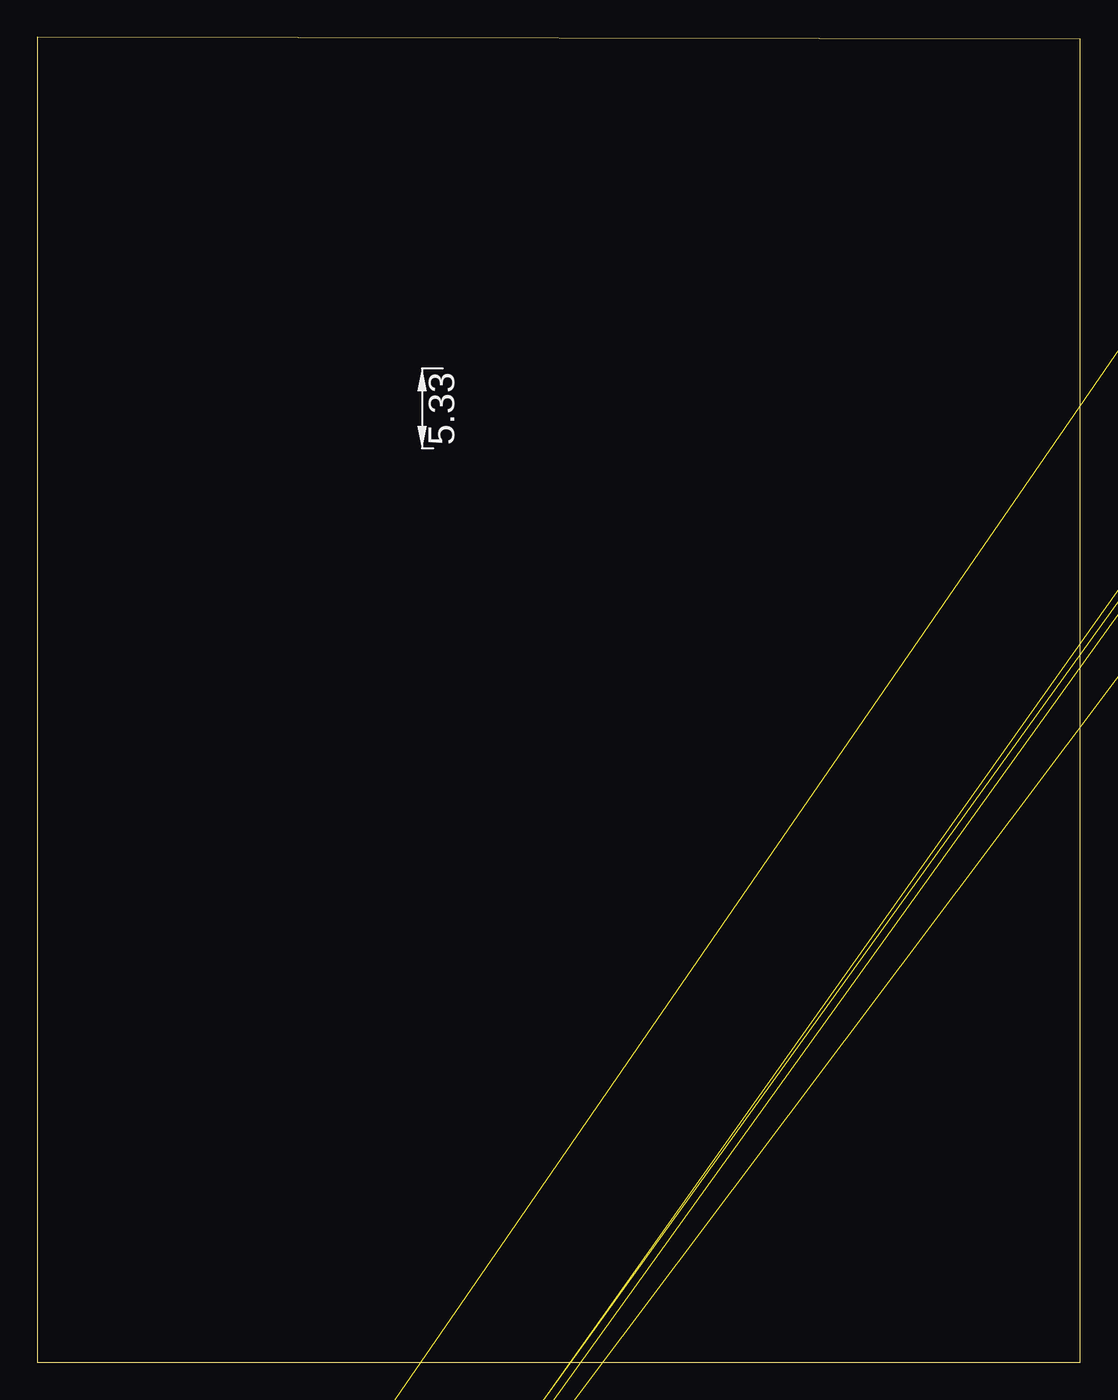
[diagram p3: board, top side]
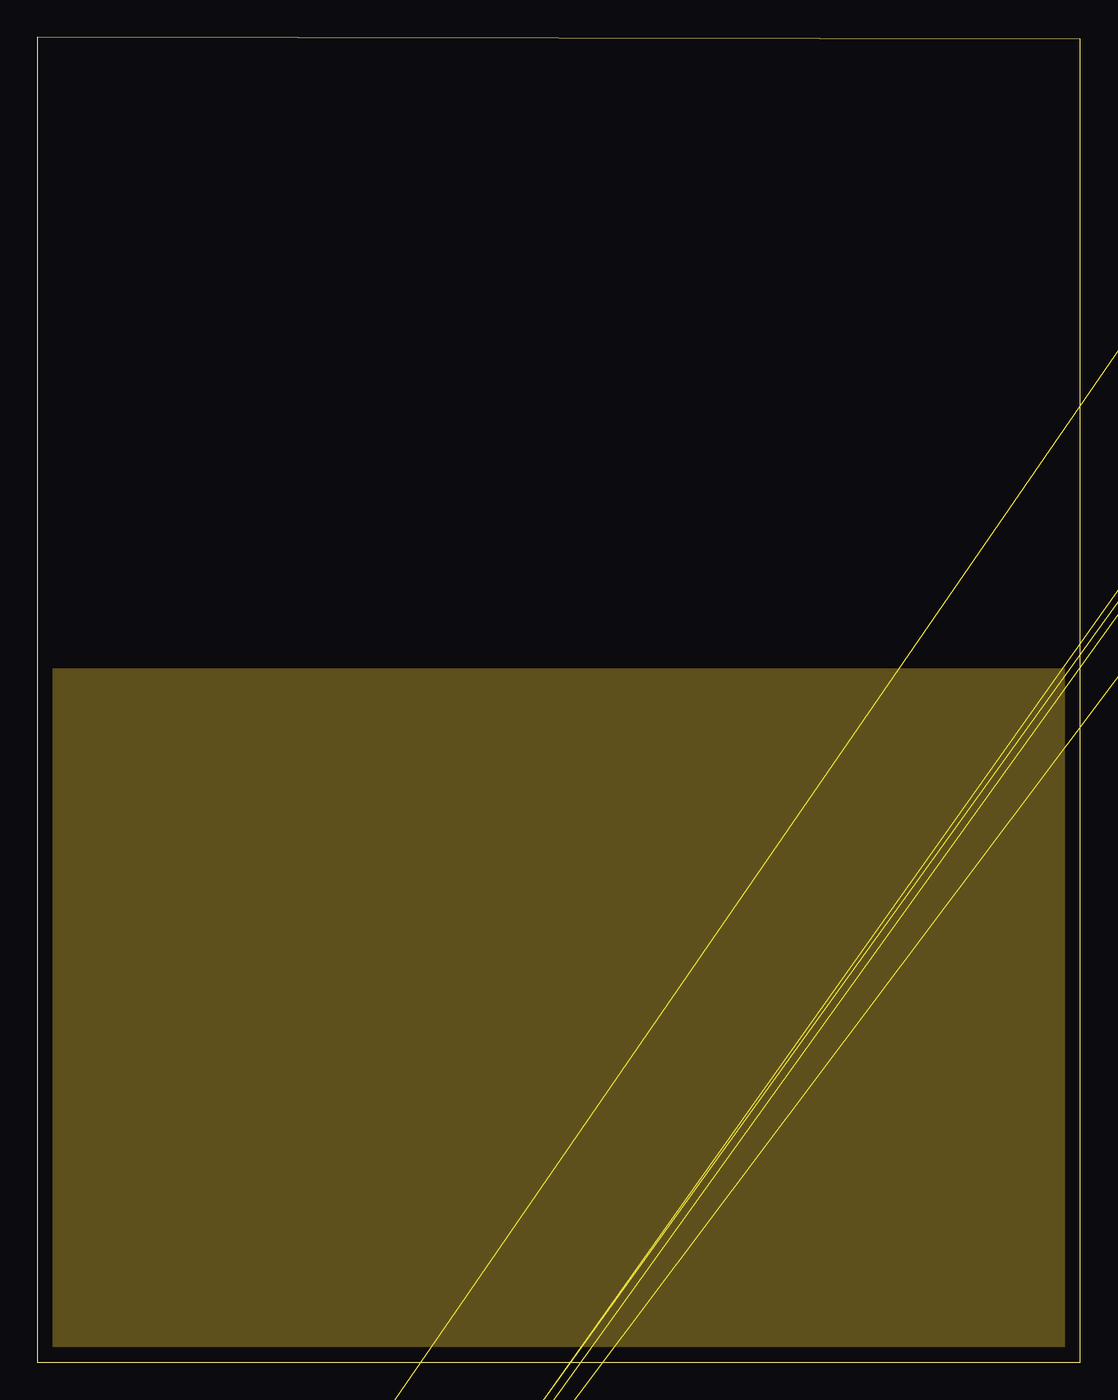
[diagram p4: board, inner layer Route2]
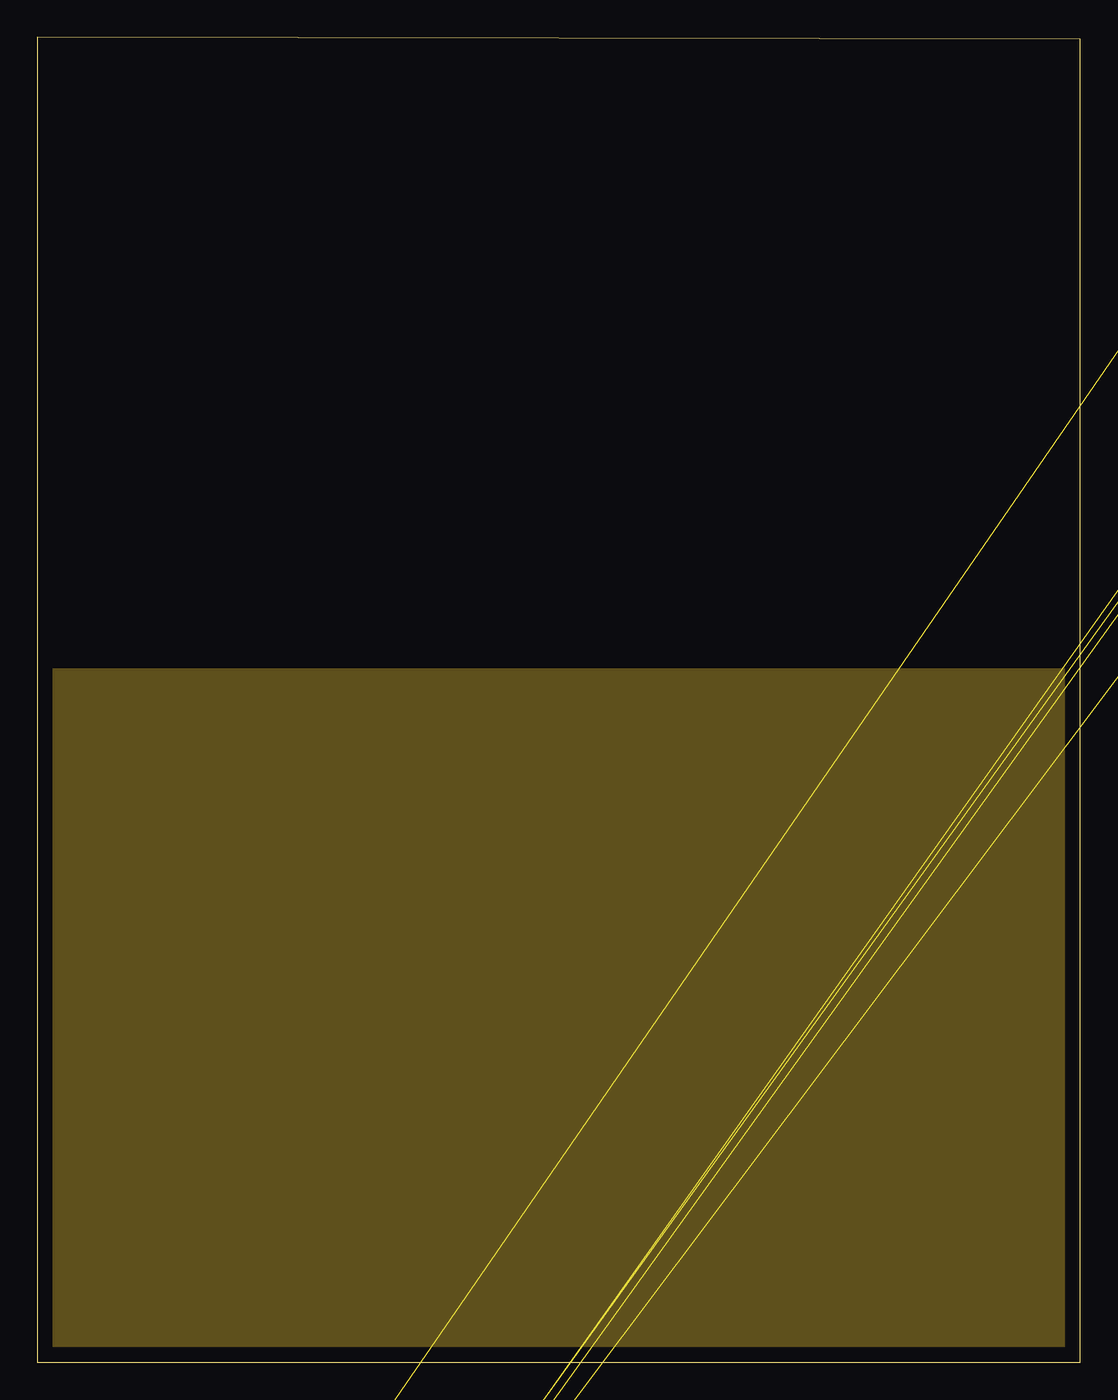
[diagram p5: board, inner layer Route15]

Size 69.6 x 88.39 mm. Coordinates in mm from the lower left corner, seen from the top.
Outline: 0,0 69.6,0 69.6,88.27 0,88.39 0,0
Copper layers (1+2*15+16): Top 0.035mm / dielectric 1.5mm / Route2 0.035mm / dielectric 0.15mm / Route15 0.035mm / dielectric 0.2mm / Bottom 0.035mm
Design rules "default *": minimum track width 6mil, minimum drill 0.35mm, track to track 6mil, track to pad 6mil, pad to pad 6mil, via to via 6mil, smd to smd 6mil, copper to edge 40mil, drill to drill 6mil, minimum pad ring 10mil, minimum via ring 8mil, stop-mask expansion 4mil, vias tented up to drill 0mil, thermal gap 10mil

### Footprints (pad centres in the part's own frame; a part is rotated, then mirrored left to right if it is on the bottom)
B32922X_(18_X_5) = drill 1 pad 1.5 square: 1 0,0 | drill 1 pad 1.5: 2 15,0
CAPPRD250W52D630H1250 = drill 0.7 pad 1.1 square: 1 0,0 | drill 0.7 pad 1.1: 2 2.5,0
CAPC1005X56N = smd 0.65 x 0.64: 1 -0.45,0; 2 0.45,0
C0402 = smd 0.62 x 0.62: 1 -0.45,0; 2 0.45,0
C4520_COMMERCIAL = smd 1.3 x 1.75: 1 -2.35,0; 2 2.35,0
CBR04C = smd 0.62 x 0.62: 1 -0.45,0; 2 0.45,0
CAPC2012X88N = smd 1.02 x 1.47: 1 -0.8,0; 2 0.8,0
SOT95P240X110-3N = smd 0.85 x 0.6: 1 -1.25,0.95; 2 -1.25,-0.95; 3 1.25,0
HDSM283L = smd 0.8 x 3: 1 -3.175,5.4; 2 -1.905,5.4; 3 -0.635,5.4; 4 0.635,5.4; 5 1.905,5.4; 6 3.175,5.4; 7 3.175,-5.4; 8 1.905,-5.4; 9 0.635,-5.4; 10 -0.635,-5.4; 11 -1.905,-5.4
RST500AMMO = drill 0.9 pad 1.4: 1 0,0; 2 5.08,0
SOIC127P600X175-8N = smd 1.525 x 0.65: 1 -2.712,1.905; 2 -2.712,0.635; 3 -2.712,-0.635; 4 -2.712,-1.905; 5 2.712,-1.905; 6 2.712,-0.635; 7 2.712,0.635; 8 2.712,1.905
SOIC127P600X175-16N = smd 1.55 x 0.65: 1 -2.725,4.445; 2 -2.725,3.175; 3 -2.725,1.905; 4 -2.725,0.635; 5 -2.725,-0.635; 6 -2.725,-1.905; 7 -2.725,-3.175; 8 -2.725,-4.445; 9 2.725,-4.445; 10 2.725,-3.175; 11 2.725,-1.905; 12 2.725,-0.635; 13 2.725,0.635; 14 2.725,1.905; 15 2.725,3.175; 16 2.725,4.445
QFN50P500X500X100-33N = smd 0.85 x 0.3: 1 -2.45,1.75; 2 -2.45,1.25; 3 -2.45,0.75; 4 -2.45,0.25; 5 -2.45,-0.25; 6 -2.45,-0.75; 7 -2.45,-1.25; 8 -2.45,-1.75; 17 2.45,-1.75; 18 2.45,-1.25; 19 2.45,-0.75; 20 2.45,-0.25; 21 2.45,0.25; 22 2.45,0.75; 23 2.45,1.25; 24 2.45,1.75 | smd 0.3 x 0.85: 9 -1.75,-2.45; 10 -1.25,-2.45; 11 -0.75,-2.45; 12 -0.25,-2.45; 13 0.25,-2.45; 14 0.75,-2.45; 15 1.25,-2.45; 16 1.75,-2.45; 25 1.75,2.45; 26 1.25,2.45; 27 0.75,2.45; 28 0.25,2.45; 29 -0.25,2.45; 30 -0.75,2.45; 31 -1.25,2.45; 32 -1.75,2.45 | smd 3.2 x 3.2: 33 0,0
QFP50P900X900X160-48N = smd 1.475 x 0.3: 1 -4.238,2.75; 2 -4.238,2.25; 3 -4.238,1.75; 4 -4.238,1.25; 5 -4.238,0.75; 6 -4.238,0.25; 7 -4.238,-0.25; 8 -4.238,-0.75; 9 -4.238,-1.25; 10 -4.238,-1.75; 11 -4.238,-2.25; 12 -4.238,-2.75; 25 4.238,-2.75; 26 4.238,-2.25; 27 4.238,-1.75; 28 4.238,-1.25; 29 4.238,-0.75; 30 4.238,-0.25; 31 4.238,0.25; 32 4.238,0.75; 33 4.238,1.25; 34 4.238,1.75; 35 4.238,2.25; 36 4.238,2.75 | smd 0.3 x 1.475: 13 -2.75,-4.238; 14 -2.25,-4.238; 15 -1.75,-4.238; 16 -1.25,-4.238; 17 -0.75,-4.238; 18 -0.25,-4.238; 19 0.25,-4.238; 20 0.75,-4.238; 21 1.25,-4.238; 22 1.75,-4.238; 23 2.25,-4.238; 24 2.75,-4.238; 37 2.75,4.238; 38 2.25,4.238; 39 1.75,4.238; 40 1.25,4.238; 41 0.75,4.238; 42 0.25,4.238; 43 -0.25,4.238; 44 -0.75,4.238; 45 -1.25,4.238; 46 -1.75,4.238; 47 -2.25,4.238; 48 -2.75,4.238
HUSSP8W50P200_2X4_800X400X500P = smd 0.75 x 2.65: 1 -3,-1.925; 2 -3,1.925; 3 -1,-1.925; 4 -1,1.925; 5 1,-1.925; 6 1,1.925; 7 3,-1.925; 8 3,1.925
J1011F01PNL = drill 0.89 pad 1.446 square: 1 0,0 | drill 0.89 pad 1.446: 2 -1.27,-2.54; 3 -2.54,0; 4 -3.81,-2.54; 5 -5.08,0; 6 -6.35,-2.54; 7 -7.62,0; 8 -8.89,-2.54 | drill 1.02 pad 1.53: 9 1.02,4.83; 10 -1.52,4.83; 11 -7.37,4.83; 12 -9.91,4.83 | drill 1.63 pad 2.445: MH1 3.43,-5.84; MH2 -12.32,-5.84 | hole 3.23: 1.27,-8.89; -10.16,-8.89
PRT13612 = drill 1.77 pad 2.655: 1 0,0; 2 15.7,0; 3 1,-13.5; 4 14.7,-13.5
G6CU1114PUSDC3 = drill 1.1 pad 1.65: 1 0,0; 3 10.16,0; 4 17.78,0; 8 0,10.16
HLKPM03 = drill 1 pad 1.5: 1 0,0; 2 0,-5; 3 29.4,5.2; 4 29.4,-10.2
IRM015 = drill 0.9 pad 1.4: 1 0,0; 2 0,-7.6; 3 28,-7.62; 4 28,7.58 | hole 4.5: 6.5,-0.02; 21.5,-0.02
ERJP03_PA3_(0603) = smd 0.65 x 0.9: 1 -0.725,0; 2 0.725,0
RESC1005X35N = smd 0.75 x 0.6: 1 -0.55,0; 2 0.55,0
RESC1005X40N = smd 0.75 x 0.6: 1 -0.55,0; 2 0.55,0
ERJS02_U02_(0402) = smd 0.475 x 0.5: 1 -0.512,0; 2 0.512,0
RESC2012X60N = smd 1 x 1.4: 1 -0.95,0; 2 0.95,0
MOV10D561K = drill 1.1 pad 1.65: 1 0,0; 2 7.5,0
SKRAAKE010_1 = smd 2.75 x 1: 1 -5.75,4; 2 0,4; 3 -5.75,0; 4 0,0
50553239 = drill 1.47 pad 2.205: 1 0,0; 2 3.175,0; 3 6.35,0; 4 6.35,6.35; 5 3.175,6.35; 6 0,6.35
NX3225GA12MHZSTDCRG2 = smd 1.4 x 1.2: 1 -1.1,-0.8; 2 1.1,-0.8; 3 1.1,0.8; 4 -1.1,0.8
FA238300000MBC0 = smd 1.4 x 1.2: 1 -1.1,-0.8; 2 1.1,-0.8; 3 1.1,0.8; 4 -1.1,0.8

### Placement (x,y rotation side)
C1  147.32,-88.9 0 top  (outside the outline)
C2  145.54,-68.58 0 top  (outside the outline)
C3  133.22,-125.6 0 top  (outside the outline)
C4  129.29,-127.89 0 top  (outside the outline)
C16  -69.6,-404.88 0 top  (outside the outline)
C17  -100.97,-408.94 0 top  (outside the outline)
C18  -83.19,-399.42 0 top  (outside the outline)
C19  -95.63,-408.94 0 top  (outside the outline)
C20  -90.55,-408.94 0 top  (outside the outline)
C28  140.21,135.25 0 top  (outside the outline)
D1  -80.39,-405.38 0 top  (outside the outline)
DS6  -98.3,-314.07 0 top  (outside the outline)
DS7  -87.38,-314.07 0 top  (outside the outline)
DS8  -76.45,-314.07 0 top  (outside the outline)
F1  144.15,-95.5 0 top  (outside the outline)
IC2  -95.89,-179.45 0 top  (outside the outline)
IC8  -97.41,-327.41 0 top  (outside the outline)
IC9  -95.89,-400.43 0 top  (outside the outline)
IC10  -84.84,-327.41 0 top  (outside the outline)
IC11  -97.41,-338.07 0 top  (outside the outline)
IC16  138.43,147.45 0 top  (outside the outline)
J1  125.98,-132.59 0 top  (outside the outline)
J4  -89.15,-359.28 0 top  (outside the outline)
J6  132.33,169.8 0 top  (outside the outline)
K1  -101.47,-393.7 0 top  (outside the outline)
PS1  143.51,-51.31 0 top  (outside the outline)
PS2(DNI)  -85.22,-148.34 0 top  (outside the outline)
R29  -74.55,-405.13 0 top  (outside the outline)
R30  197.49,57.28 0 top  (outside the outline)
R31  178.69,41.66 0 top  (outside the outline)
R32  177.67,39.37 0 top  (outside the outline)
R33  177.67,50.42 0 top  (outside the outline)
R34  178.69,30.61 0 top  (outside the outline)
R35  177.67,28.32 0 top  (outside the outline)
R51  -85.85,-408.94 0 top  (outside the outline)
R52  -81.41,-408.94 0 top  (outside the outline)
R53  -76.96,-408.94 0 top  (outside the outline)
R54  -72.52,-408.94 0 top  (outside the outline)
R55  -86.49,-411.48 0 top  (outside the outline)
R56  -82.3,-411.48 0 top  (outside the outline)
R57  -78.11,-411.48 0 top  (outside the outline)
R58  -100.84,-411.48 0 top  (outside the outline)
R59  -73.91,-411.48 0 top  (outside the outline)
R60  -95.63,-411.48 0 top  (outside the outline)
R61  -90.93,-411.48 0 top  (outside the outline)
R85  -96.65,-349.12 0 top  (outside the outline)
R86  -92.46,-349.12 0 top  (outside the outline)
R87  -88.27,-349.12 0 top  (outside the outline)
R88  -84.07,-349.12 0 top  (outside the outline)
R89  -79.88,-349.12 0 top  (outside the outline)
R90  -75.69,-349.12 0 top  (outside the outline)
R91  -71.5,-349.12 0 top  (outside the outline)
R92  -101.6,-351.41 0 top  (outside the outline)
R93  -97.41,-351.41 0 top  (outside the outline)
R94  -93.22,-351.41 0 top  (outside the outline)
R95  -89.03,-351.41 0 top  (outside the outline)
R96  -84.84,-351.41 0 top  (outside the outline)
R97  -80.64,-351.41 0 top  (outside the outline)
R98  -76.45,-351.41 0 top  (outside the outline)
R99  -72.26,-351.41 0 top  (outside the outline)
R100  -88.52,-333.88 0 top  (outside the outline)
R101  -83.31,-333.88 0 top  (outside the outline)
R102  -78.11,-333.88 0 top  (outside the outline)
R103  -72.9,-333.88 0 top  (outside the outline)
R104  -101.09,-344.55 0 top  (outside the outline)
R105  -95.89,-344.55 0 top  (outside the outline)
R106  -90.68,-344.55 0 top  (outside the outline)
R107  -85.47,-344.55 0 top  (outside the outline)
R108  -80.26,-344.55 0 top  (outside the outline)
R109  -75.06,-344.55 0 top  (outside the outline)
R110  -101.22,-346.84 0 top  (outside the outline)
R111  -101.22,-349.12 0 top  (outside the outline)
R112  -96.14,-346.84 0 top  (outside the outline)
R113  -91.06,-346.84 0 top  (outside the outline)
R114  -85.98,-346.84 0 top  (outside the outline)
R115  -80.9,-346.84 0 top  (outside the outline)
R116  -75.82,-346.84 0 top  (outside the outline)
R117  -70.74,-346.84 0 top  (outside the outline)
RV1  142.62,-81.28 0 top  (outside the outline)
S1  207.01,72.64 0 top  (outside the outline)
S2  177.67,44.07 0 top  (outside the outline)
S3  177.67,33.02 0 top  (outside the outline)
U2  154.18,-73.41 0 top  (outside the outline)
U3  164.85,-73.41 0 top  (outside the outline)
Y1  143.13,-121.92 0 top  (outside the outline)
Y3  -93.73,-405.64 0 top  (outside the outline)

### Tracks (layer width: path | path; a pad name or v marks a point on that pad's centre or on a via)
+3.3V  (14 unrouted)
  pour Route2: 0.38,0.38 0.38,46.23 69.22,46.23 69.22,0.38
+5V  (8 unrouted)
BTN_DN  (2 unrouted)
BTN_MENU  (2 unrouted)
BTN_UP  (2 unrouted)
CHAR_1B  (1 unrouted)
CHAR_1C  (1 unrouted)
CHAR_1D  (1 unrouted)
CHAR_1E  (1 unrouted)
CHAR_1F  (1 unrouted)
CHAR_1G  (1 unrouted)
CHAR_2A  (2 unrouted)
CHAR_2B  (1 unrouted)
CHAR_2C  (1 unrouted)
CHAR_2D  (1 unrouted)
CHAR_2E  (1 unrouted)
CHAR_2F  (1 unrouted)
CHAR_2G  (1 unrouted)
CHAR_3A  (1 unrouted)
CHAR_3B  (1 unrouted)
CHAR_3C  (1 unrouted)
CHAR_3D  (1 unrouted)
CHAR_3E  (1 unrouted)
CHAR_3F  (1 unrouted)
CHAR_3G  (1 unrouted)
GND  (60 unrouted)
  pour Route15: 0.38,0.38 0.38,46.23 69.22,46.23 69.22,0.38
IN_1A  (1 unrouted)
IN_1B  (1 unrouted)
IN_1C  (1 unrouted)
IN_1D  (1 unrouted)
IN_2A  (1 unrouted)
IN_2B  (1 unrouted)
IN_2C  (1 unrouted)
IN_2D  (1 unrouted)
IN_3A  (1 unrouted)
IN_3B  (1 unrouted)
IN_3C  (1 unrouted)
IN_3D  (1 unrouted)
INTRN  (1 unrouted)
JTAGSEL  (1 unrouted)
L  (6 unrouted)
MISO  (3 unrouted)
N  (9 unrouted)
N$1  (4 unrouted)
N$2  (2 unrouted)
N$3  (2 unrouted)
N$55  (1 unrouted)
N$56  (1 unrouted)
N$57  (1 unrouted)
N$58  (1 unrouted)
N$59  (1 unrouted)
N$60  (1 unrouted)
N$61  (1 unrouted)
N$62  (1 unrouted)
N$63  (1 unrouted)
N$64  (1 unrouted)
N$65  (1 unrouted)
N$66  (1 unrouted)
N$67  (1 unrouted)
N$68  (1 unrouted)
N$69  (1 unrouted)
N$70  (1 unrouted)
N$71  (1 unrouted)
N$72  (1 unrouted)
N$73  (1 unrouted)
N$74  (1 unrouted)
N$75  (1 unrouted)
N$78  (2 unrouted)
N$80  (1 unrouted)
N$82  (1 unrouted)
N$84  (1 unrouted)
N$120  (2 unrouted)
N$121  (2 unrouted)
N$122  (2 unrouted)
N$123  (2 unrouted)
N$124  (2 unrouted)
N$125  (2 unrouted)
N$126  (1 unrouted)
N$127  (1 unrouted)
N$128  (1 unrouted)
N$129  (1 unrouted)
N$130  (2 unrouted)
N$131  (2 unrouted)
N$132  (1 unrouted)
N$221  (2 unrouted)
N$225  (1 unrouted)
NPCS0  (1 unrouted)
NPCS1  (1 unrouted)
NRST  (1 unrouted)
RELAY_CTRL  (1 unrouted)
RESET  (1 unrouted)
SPCK  (2 unrouted)
SPI_MOSI  (1 unrouted)
TCK  (1 unrouted)
TDI  (1 unrouted)
TDO  (1 unrouted)
TMS  (1 unrouted)
VCC_EDBG_P3V3  (3 unrouted)